# Altium project ProjectUshi.PrjPcb
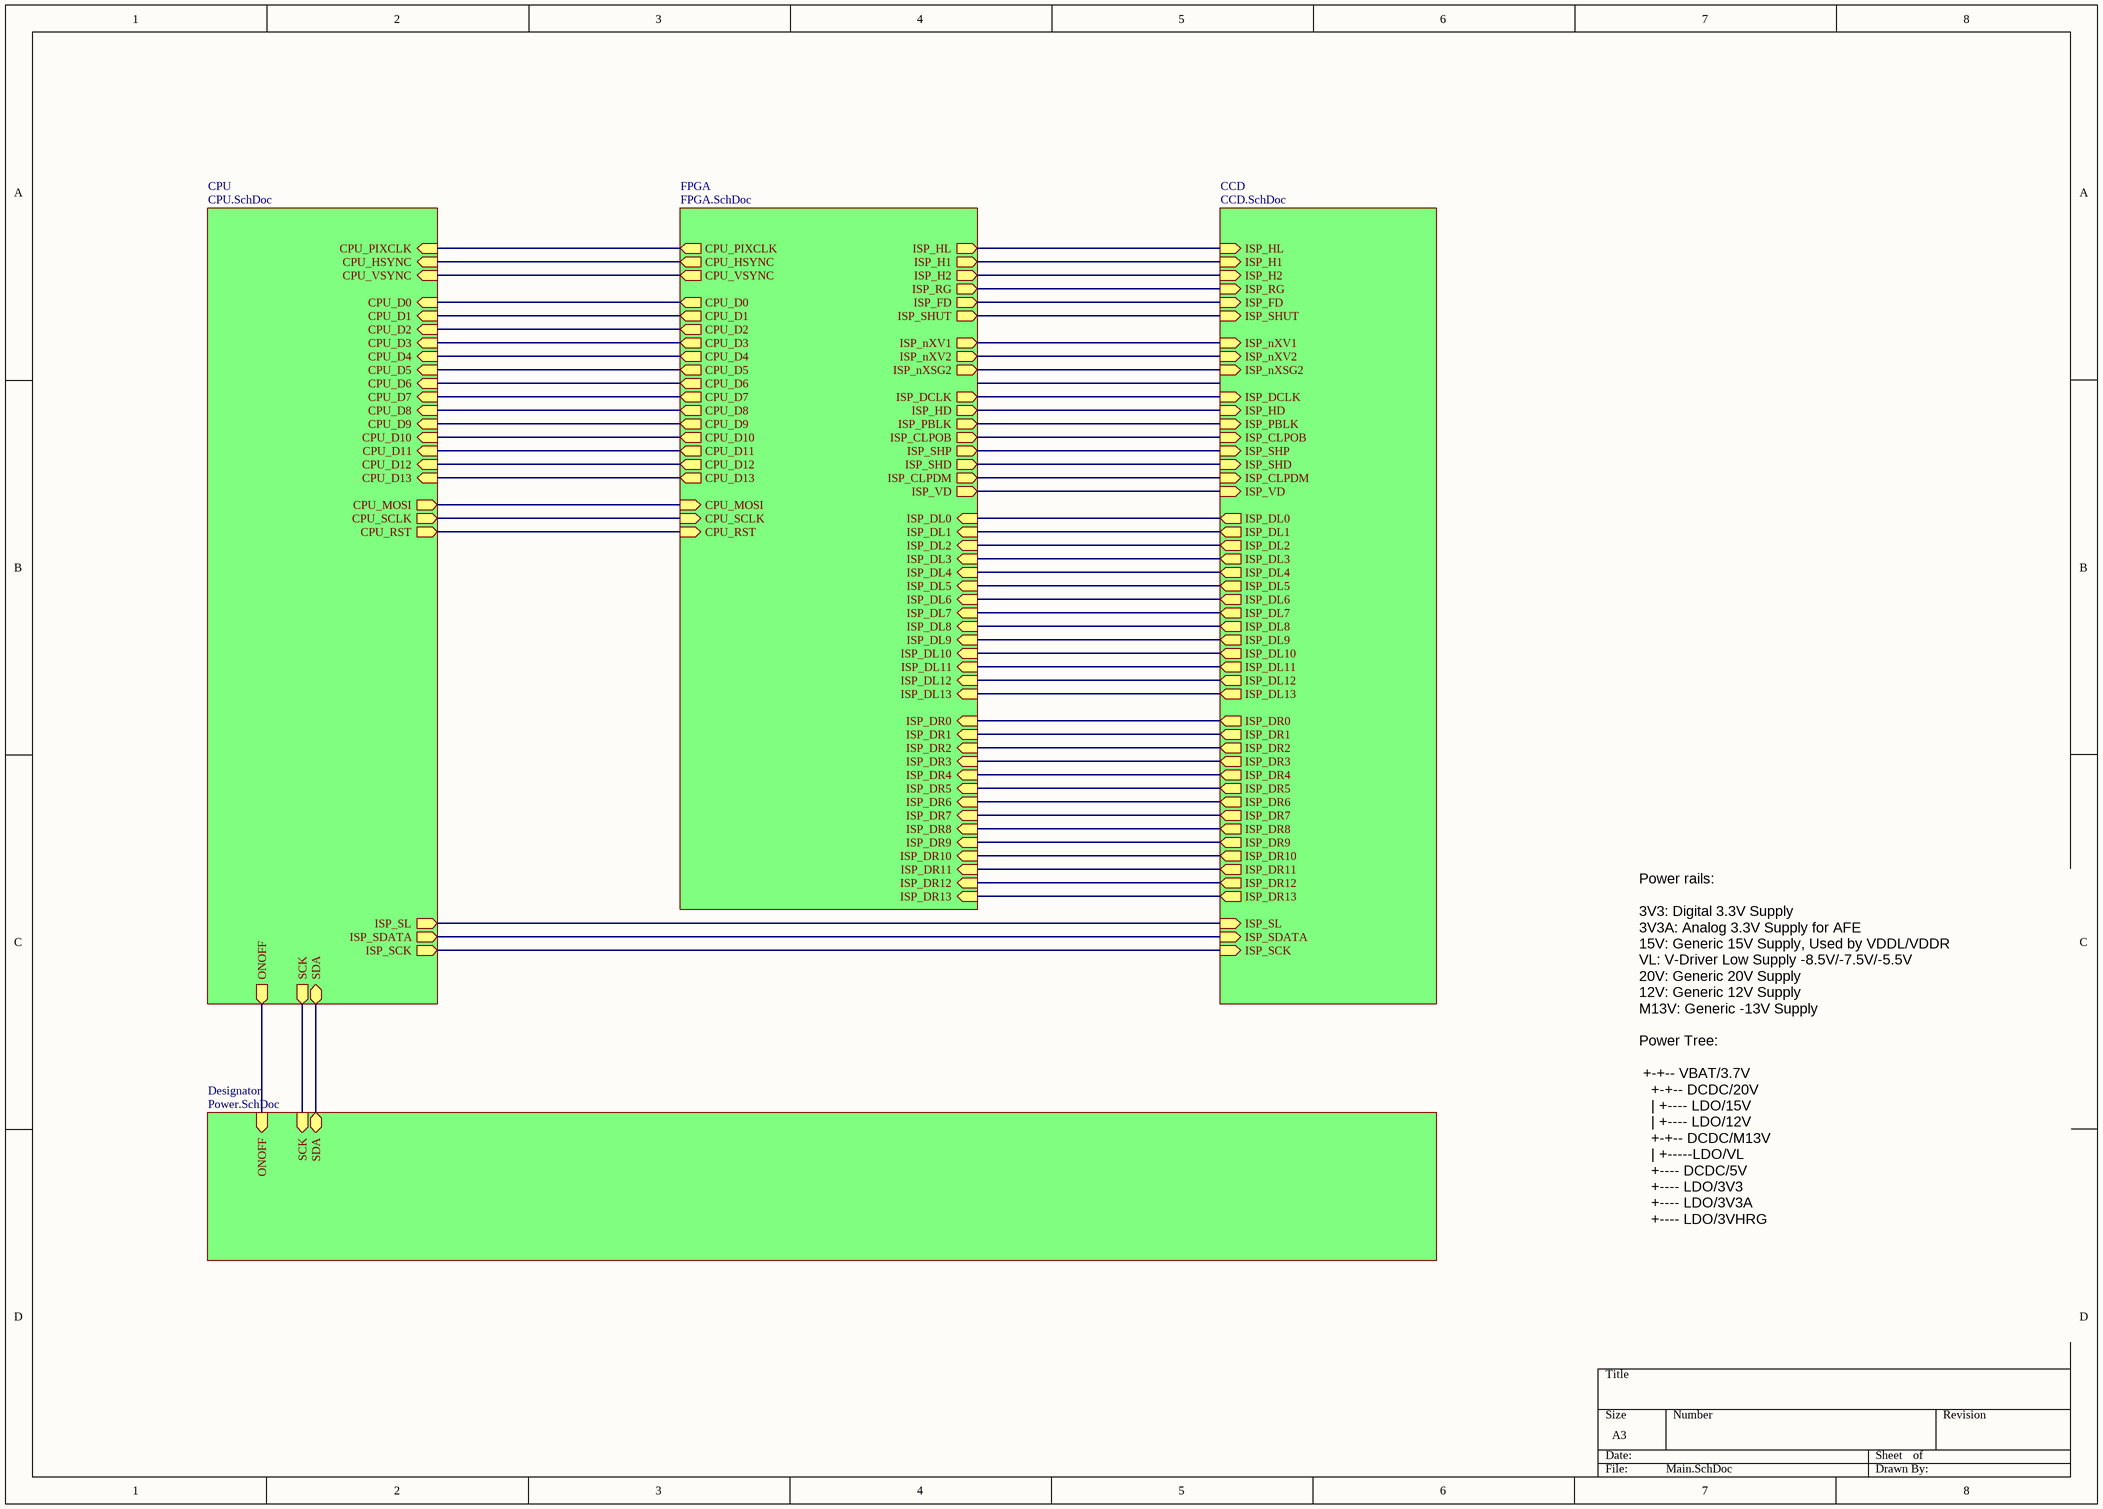
[diagram p0: Main.SchDoc]
5 sheets, 331 parts. Net scope: hierarchical (ports join the sheet entries above them; power ports are global).
Sheets:
  Main.SchDoc
    CCD = CCD.SchDoc
    FPGA = FPGA.SchDoc
    CPU = CPU.SchDoc
    Designator = Power.SchDoc

## Sheet Main.SchDoc
size A3

### Sub-sheets
CCD = CCD.SchDoc: ISP_HL (in), ISP_H1 (in), ISP_H2 (in), ISP_RG (in), ISP_FD (in), ISP_SHUT (in), ISP_nXV1 (in), ISP_nXV2 (in), ISP_nXSG2 (in), ISP_DCLK (in), ISP_HD (in), ISP_PBLK (in), ISP_CLPOB (in), ISP_SHP (in), ISP_SHD (in), ISP_CLPDM (in), ISP_VD (in), ISP_SL (in), ISP_SDATA (in), ISP_SCK (in), ISP_DL0 (out), ISP_DL1 (out), ISP_DL2 (out), ISP_DL3 (out), ISP_DL4 (out), ISP_DL5 (out), ISP_DL6 (out), ISP_DL7 (out), ISP_DL8 (out), ISP_DL9 (out), ISP_DL10 (out), ISP_DL11 (out), ISP_DL12 (out), ISP_DL13 (out), ISP_DR0 (out), ISP_DR1 (out), ISP_DR2 (out), ISP_DR3 (out), ISP_DR4 (out), ISP_DR5 (out), ISP_DR6 (out), ISP_DR7 (out), ISP_DR8 (out), ISP_DR9 (out), ISP_DR10 (out), ISP_DR11 (out), ISP_DR12 (out), ISP_DR13 (out)
CPU = CPU.SchDoc: CPU_PIXCLK (in), CPU_HSYNC (in), CPU_VSYNC (in), CPU_D0 (in), CPU_D1 (in), CPU_D2 (in), CPU_D3 (in), CPU_D4 (in), CPU_D5 (in), CPU_D6 (in), CPU_D7 (in), CPU_D8 (in), CPU_D9 (in), CPU_D10 (in), CPU_D11 (in), CPU_D12 (in), CPU_D13 (in), CPU_MOSI (out), CPU_SCLK (out), CPU_RST (out), ISP_SL (out), ISP_SDATA (out), ISP_SCK (out), ONOFF (out), SCK (out), SDA (bidir)
Designator = Power.SchDoc: ONOFF (in), SCK (in), SDA (bidir)
FPGA = FPGA.SchDoc: ISP_HL (out), ISP_H1 (out), ISP_H2 (out), ISP_RG (out), ISP_FD (out), ISP_SHUT (out), ISP_nXV1 (out), ISP_nXV2 (out), ISP_nXSG2 (out), ISP_DCLK (out), ISP_HD (out), ISP_PBLK (out), ISP_CLPOB (out), ISP_SHP (out), ISP_SHD (out), ISP_CLPDM (out), ISP_VD (out), ISP_DL0 (in), ISP_DL1 (in), ISP_DL2 (in), ISP_DL3 (in), ISP_DL4 (in), ISP_DL5 (in), ISP_DL6 (in), ISP_DL7 (in), ISP_DL8 (in), ISP_DL9 (in), ISP_DL10 (in), ISP_DL11 (in), ISP_DL12 (in), ISP_DL13 (in), ISP_DR0 (in), ISP_DR1 (in), ISP_DR2 (in), ISP_DR3 (in), ISP_DR4 (in), ISP_DR5 (in), ISP_DR6 (in), ISP_DR7 (in), ISP_DR8 (in), ISP_DR9 (in), ISP_DR10 (in), ISP_DR11 (in), ISP_DR12 (in), ISP_DR13 (in), CPU_PIXCLK (out), CPU_HSYNC (out), CPU_VSYNC (out), CPU_D0 (out), CPU_D1 (out), CPU_D2 (out), CPU_D3 (out), CPU_D4 (out), CPU_D5 (out), CPU_D6 (out), CPU_D7 (out), CPU_D8 (out), CPU_D9 (out), CPU_D10 (out), CPU_D11 (out), CPU_D12 (out), CPU_D13 (out), CPU_MOSI (in), CPU_SCLK (in), CPU_RST (in)

### Nets
CPU_D0: sheet FPGA/CPU_D0, sheet CPU/CPU_D0
CPU_D1: sheet FPGA/CPU_D1, sheet CPU/CPU_D1
CPU_D2: sheet FPGA/CPU_D2, sheet CPU/CPU_D2
CPU_D3: sheet FPGA/CPU_D3, sheet CPU/CPU_D3
CPU_D4: sheet FPGA/CPU_D4, sheet CPU/CPU_D4
CPU_D5: sheet FPGA/CPU_D5, sheet CPU/CPU_D5
CPU_D6: sheet FPGA/CPU_D6, sheet CPU/CPU_D6
CPU_D7: sheet FPGA/CPU_D7, sheet CPU/CPU_D7
CPU_D8: sheet FPGA/CPU_D8, sheet CPU/CPU_D8
CPU_D9: sheet FPGA/CPU_D9, sheet CPU/CPU_D9
CPU_D10: sheet FPGA/CPU_D10, sheet CPU/CPU_D10
CPU_D11: sheet FPGA/CPU_D11, sheet CPU/CPU_D11
CPU_D12: sheet FPGA/CPU_D12, sheet CPU/CPU_D12
CPU_D13: sheet FPGA/CPU_D13, sheet CPU/CPU_D13
CPU_HSYNC: sheet FPGA/CPU_HSYNC, sheet CPU/CPU_HSYNC
CPU_MOSI: sheet FPGA/CPU_MOSI, sheet CPU/CPU_MOSI
CPU_PIXCLK: sheet FPGA/CPU_PIXCLK, sheet CPU/CPU_PIXCLK
CPU_RST: sheet FPGA/CPU_RST, sheet CPU/CPU_RST
CPU_SCLK: sheet FPGA/CPU_SCLK, sheet CPU/CPU_SCLK
CPU_VSYNC: sheet FPGA/CPU_VSYNC, sheet CPU/CPU_VSYNC
FPGA_DL0: sheet CCD/ISP_DL0, sheet FPGA/ISP_DL0
FPGA_DL1: sheet CCD/ISP_DL1, sheet FPGA/ISP_DL1
FPGA_DL2: sheet CCD/ISP_DL2, sheet FPGA/ISP_DL2
FPGA_DL3: sheet CCD/ISP_DL3, sheet FPGA/ISP_DL3
FPGA_DL4: sheet CCD/ISP_DL4, sheet FPGA/ISP_DL4
FPGA_DL5: sheet CCD/ISP_DL5, sheet FPGA/ISP_DL5
FPGA_DL6: sheet CCD/ISP_DL6, sheet FPGA/ISP_DL6
FPGA_DL7: sheet CCD/ISP_DL7, sheet FPGA/ISP_DL7
FPGA_DL8: sheet CCD/ISP_DL8, sheet FPGA/ISP_DL8
FPGA_DL9: sheet CCD/ISP_DL9, sheet FPGA/ISP_DL9
FPGA_DL10: sheet CCD/ISP_DL10, sheet FPGA/ISP_DL10
FPGA_DL11: sheet CCD/ISP_DL11, sheet FPGA/ISP_DL11
FPGA_DL12: sheet CCD/ISP_DL12, sheet FPGA/ISP_DL12
FPGA_DL13: sheet CCD/ISP_DL13, sheet FPGA/ISP_DL13
FPGA_DR0: sheet CCD/ISP_DR0, sheet FPGA/ISP_DR0
FPGA_DR1: sheet CCD/ISP_DR1, sheet FPGA/ISP_DR1
FPGA_DR2: sheet CCD/ISP_DR2, sheet FPGA/ISP_DR2
FPGA_DR3: sheet CCD/ISP_DR3, sheet FPGA/ISP_DR3
FPGA_DR4: sheet CCD/ISP_DR4, sheet FPGA/ISP_DR4
FPGA_DR5: sheet CCD/ISP_DR5, sheet FPGA/ISP_DR5
FPGA_DR6: sheet CCD/ISP_DR6, sheet FPGA/ISP_DR6
FPGA_DR7: sheet CCD/ISP_DR7, sheet FPGA/ISP_DR7
FPGA_DR8: sheet CCD/ISP_DR8, sheet FPGA/ISP_DR8
FPGA_DR9: sheet CCD/ISP_DR9, sheet FPGA/ISP_DR9
FPGA_DR10: sheet CCD/ISP_DR10, sheet FPGA/ISP_DR10
FPGA_DR11: sheet CCD/ISP_DR11, sheet FPGA/ISP_DR11
FPGA_DR12: sheet CCD/ISP_DR12, sheet FPGA/ISP_DR12
FPGA_DR13: sheet CCD/ISP_DR13, sheet FPGA/ISP_DR13
I2C1_SCL: sheet CPU/SCK, sheet Designator/SCK
I2C1_SDA: sheet CPU/SDA, sheet Designator/SDA
ISP_CLPDM: sheet CCD/ISP_CLPDM, sheet FPGA/ISP_CLPDM
ISP_CLPOB: sheet CCD/ISP_CLPOB, sheet FPGA/ISP_CLPOB
ISP_DCLK: sheet CCD/ISP_DCLK, sheet FPGA/ISP_DCLK
ISP_FD: sheet CCD/ISP_FD, sheet FPGA/ISP_FD
ISP_H1: sheet CCD/ISP_H1, sheet FPGA/ISP_H1
ISP_H2: sheet CCD/ISP_H2, sheet FPGA/ISP_H2
ISP_HD: sheet CCD/ISP_HD, sheet FPGA/ISP_HD
ISP_HL: sheet CCD/ISP_HL, sheet FPGA/ISP_HL
ISP_nXSG2: sheet CCD/ISP_nXSG2, sheet FPGA/ISP_nXSG2
ISP_nXV1: sheet CCD/ISP_nXV1, sheet FPGA/ISP_nXV1
ISP_nXV2: sheet CCD/ISP_nXV2, sheet FPGA/ISP_nXV2
ISP_PBLK: sheet CCD/ISP_PBLK, sheet FPGA/ISP_PBLK
ISP_RG: sheet CCD/ISP_RG, sheet FPGA/ISP_RG
ISP_SCK: sheet CCD/ISP_SCK, sheet CPU/ISP_SCK
ISP_SDATA: sheet CCD/ISP_SDATA, sheet CPU/ISP_SDATA
ISP_SHD: sheet CCD/ISP_SHD, sheet FPGA/ISP_SHD
ISP_SHP: sheet CCD/ISP_SHP, sheet FPGA/ISP_SHP
ISP_SHUT: sheet CCD/ISP_SHUT, sheet FPGA/ISP_SHUT
ISP_SL: sheet CCD/ISP_SL, sheet CPU/ISP_SL
ISP_VD: sheet CCD/ISP_VD, sheet FPGA/ISP_VD
ONOFF: sheet CPU/ONOFF, sheet Designator/ONOFF

### Notes on the sheet
- Power rails:
  3V3: Digital 3.3V Supply
  3V3A: Analog 3.3V Supply for AFE
  15V: Generic 15V Supply, Used by VDDL/VDDR
  VL: V-Driver Low Supply -8.5V/-7.5V/-5.5V
  20V: Generic 20V Supply
  12V: Generic 12V Supply
  M13V: Generic -13V Supply
  Power Tree:
  +-+-- VBAT/3.7V
  +-+-- DCDC/20V
  | +---- LDO/15V
  | +---- LDO/12V
  +-+-- DCDC/M13V
  | +-----LDO/VL
  +---- DCDC/5V
  +---- LDO/3V3
  +---- LDO/3V3A
  +---- LDO/3VHRG

## Sheet CCD.SchDoc
size A3
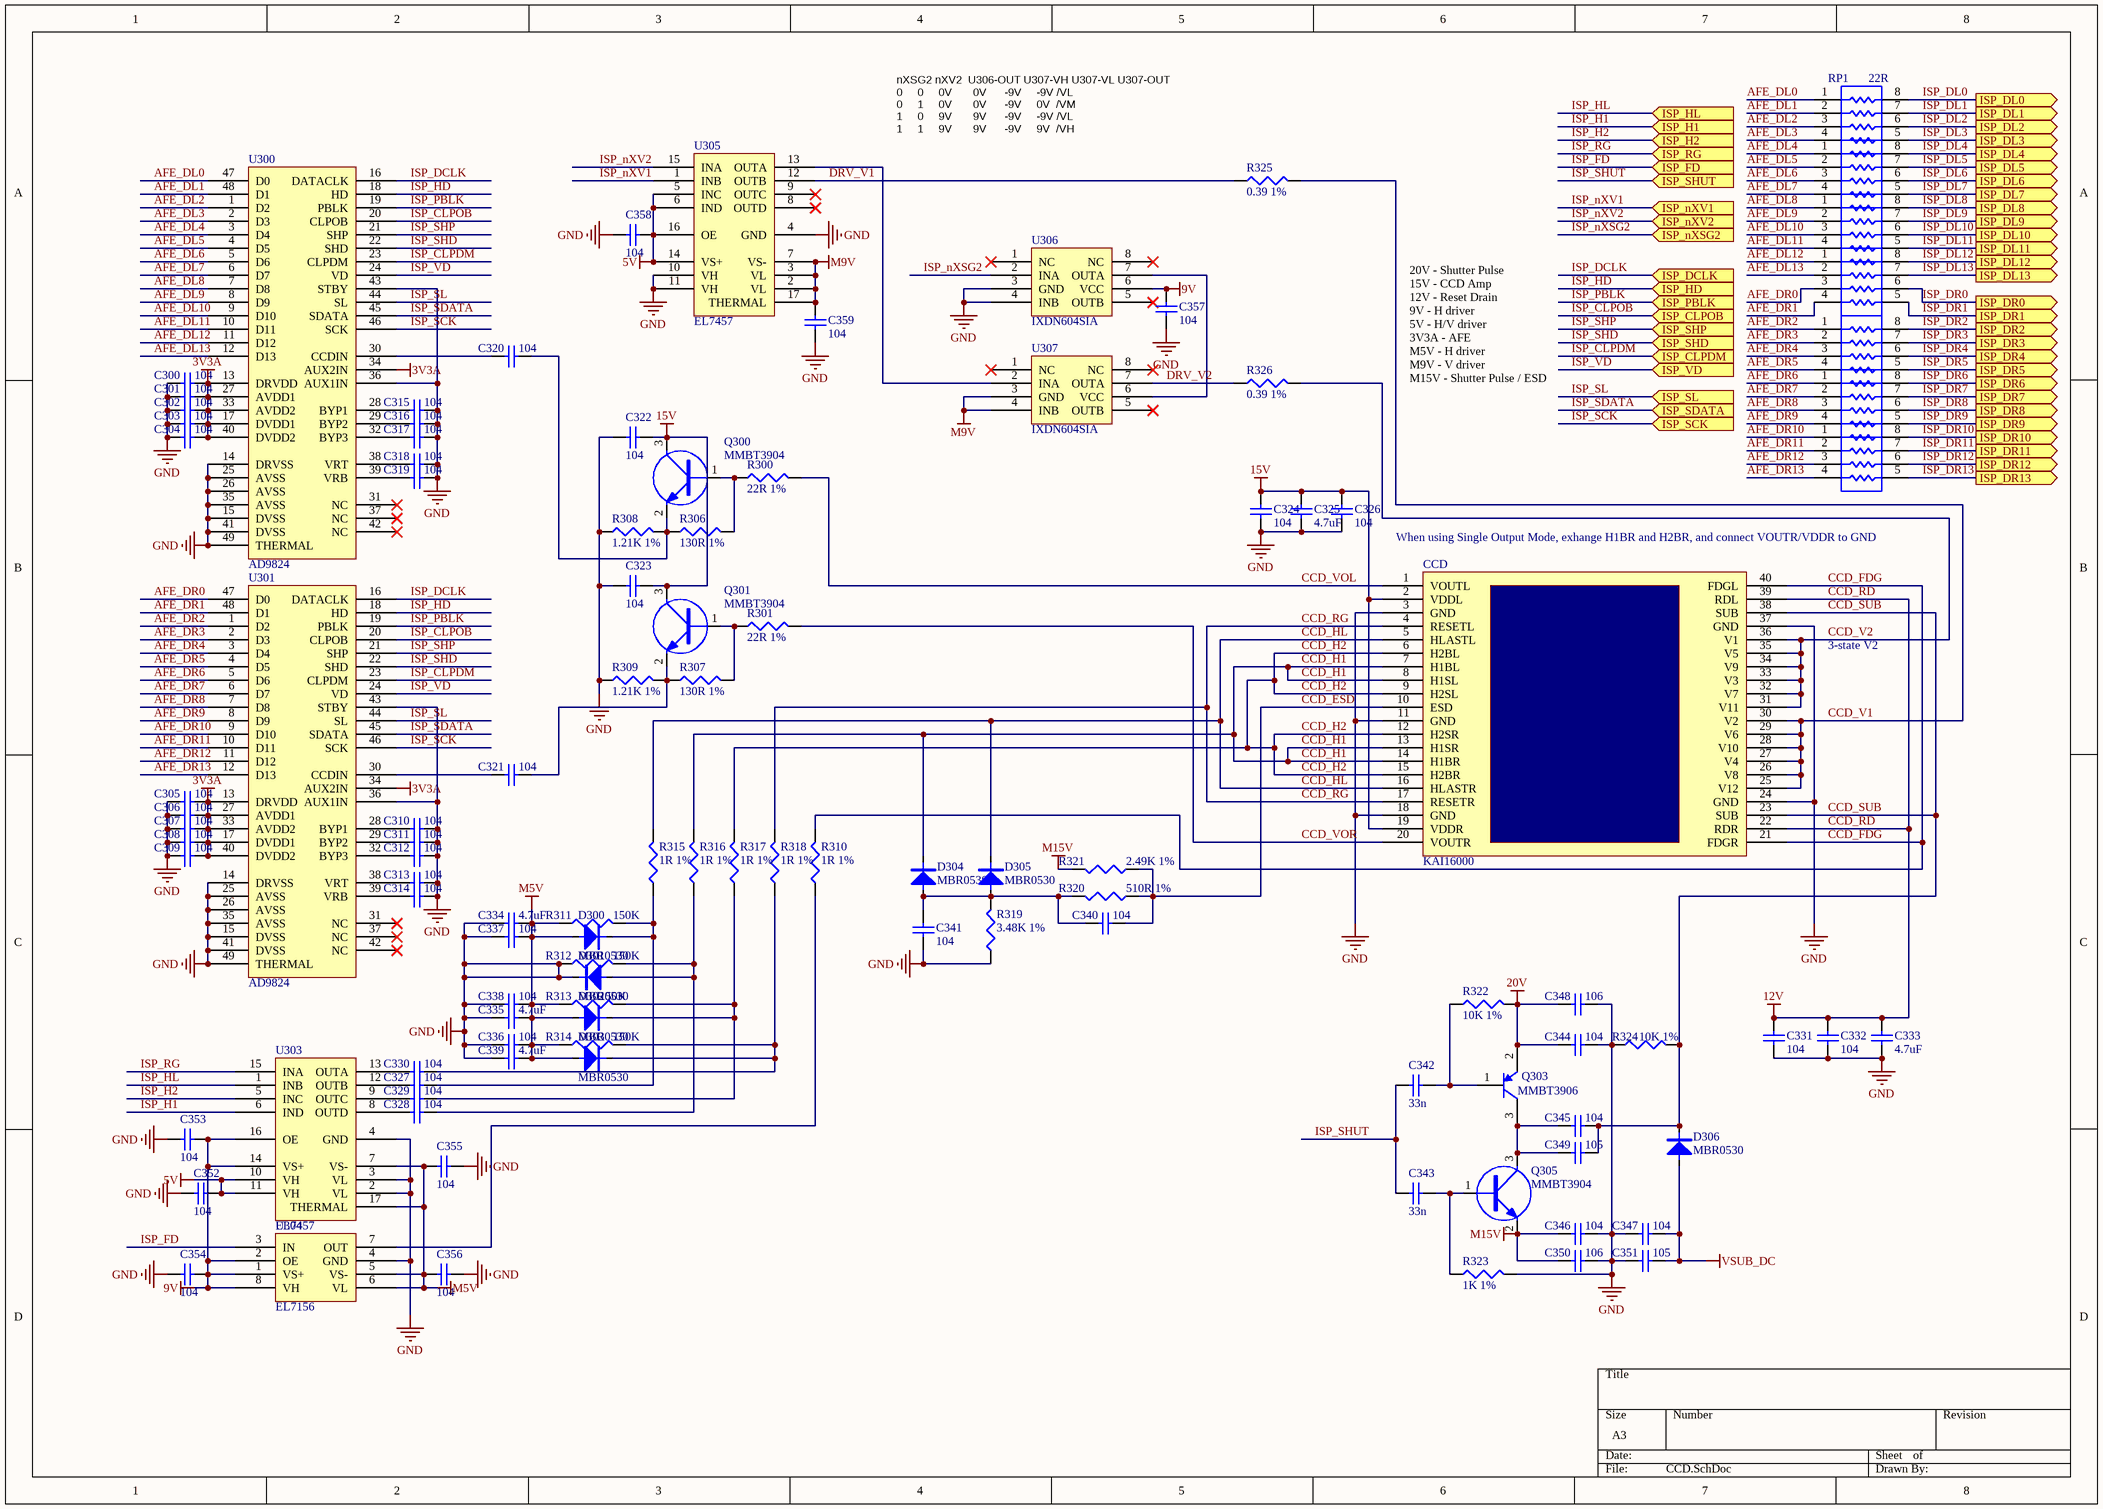
[diagram p1: CCD.SchDoc]

### Parts
C300  104  [C0402]
C301  104  [C0402]
C302  104  [C0402]
C303  104  [C0402]
C304  104  [C0402]
C305  104  [C0402]
C306  104  [C0402]
C307  104  [C0402]
C308  104  [C0402]
C309  104  [C0402]
C310  104  [C0402]
C311  104  [C0402]
C312  104  [C0402]
C313  104  [C0402]
C314  104  [C0402]
C315  104  [C0402]
C316  104  [C0402]
C317  104  [C0402]
C318  104  [C0402]
C319  104  [C0402]
C320  104  [C0402]
C321  104  [C0402]
C322  104  [C0402]
C323  104  [C0402]
C324  104  [C0402]
C325  4.7uF  [C0603]
C326  104  [C0402]
C327  104  [C0402]
C328  104  [C0402]
C329  104  [C0402]
C330  104  [C0402]
C331  104  [C0402]
C332  104  [C0402]
C333  4.7uF  [C0603]
C334  104  [C0603]
C335  4.7uF  [C0603]
C336  104  [C0603]
C337  4.7uF  [C0603]
C338  104  [C0603]
C339  4.7uF  [C0603]
C340  104  [C0603]
C341  104  [C0603]
C342  33n  [C0402]
C343  33n  [C0402]
C344  104  [C0402]
C345  104  [C0402]
C346  104  [C0402]
C347  104  [C0402]
C348  106  [C0805]
C349  105  [C0805]
C350  106  [C0805]
C351  105  [C0805]
C352  104  [C0603]
C353  104  [C0603]
C354  104  [C0603]
C355  104  [C0603]
C356  104  [C0603]
C357  104  [C0603]
C358  104  [C0603]
C359  104  [C0603]
CCD  KAI16000  [KAI16000]
D300  MBR0530  [SOD123]
D301  MBR0530  [SOD123]
D302  MBR0530  [SOD123]
D303  MBR0530  [SOD123]
D304  MBR0530  [SOD123]
D305  MBR0530  [SOD123]
D306  MBR0530  [SOD123]
Q300  MMBT3904  [SOT23]
Q301  MMBT3904  [SOT23]
Q303  MMBT3906  [SOT23]
Q305  MMBT3904  [SOT23]
R300  22R 1%  [R0603]
R301  22R 1%  [R0603]
R306  130R 1%  [R0603]
R307  130R 1%  [R0603]
R308  1.21K 1%  [R0603]
R309  1.21K 1%  [R0603]
R310  1R 1%  [R0805]
R311  150K  [R0603]
R312  150K  [R0603]
R313  150K  [R0603]
R314  150K  [R0603]
R315  1R 1%  [R0805]
R316  1R 1%  [R0805]
R317  1R 1%  [R0805]
R318  1R 1%  [R0805]
R319  3.48K 1%  [R0603]
R320  510R 1%  [R0603]
R321  2.49K 1%  [R0603]
R322  10K 1%  [R0603]
R323  1K 1%  [R0603]
R324  10K 1%  [R0603]
R325  0.39 1%  [R0603]
R326  0.39 1%  [R0603]
RP1  22R  [R0402S4]
RP2  22R  [R0402S4]  (value not drawn)
RP3  22R  [R0402S4]  (value not drawn)
RP4  22R  [R0402S4]  (value not drawn)
RP5  22R  [R0402S4]  (value not drawn)
RP6  22R  [R0402S4]  (value not drawn)
RP7  22R  [R0402S4]  (value not drawn)
U300  AD9824  [CP-48]
U301  AD9824  [CP-48]
U303  EL7457  [QFN16]
U304  EL7156  [SOP-8]
U305  EL7457  [QFN16]
U306  IXDN604SIA  [SOP8]
U307  IXDN604SIA  [SOP8]

### Ports
ISP_CLPDM (in), ISP_CLPOB (in), ISP_DCLK (in), ISP_DL0 (out), ISP_DL1 (out), ISP_DL2 (out), ISP_DL3 (out), ISP_DL4 (out), ISP_DL5 (out), ISP_DL6 (out), ISP_DL7 (out), ISP_DL8 (out), ISP_DL9 (out), ISP_DL10 (out), ISP_DL11 (out), ISP_DL12 (out), ISP_DL13 (out), ISP_DR0 (out), ISP_DR1 (out), ISP_DR2 (out), ISP_DR3 (out), ISP_DR4 (out), ISP_DR5 (out), ISP_DR6 (out), ISP_DR7 (out), ISP_DR8 (out), ISP_DR9 (out), ISP_DR10 (out), ISP_DR11 (out), ISP_DR12 (out), ISP_DR13 (out), ISP_FD (in), ISP_H1 (in), ISP_H2 (in), ISP_HD (in), ISP_HL (in), ISP_nXSG2 (in), ISP_nXV1 (in), ISP_nXV2 (in), ISP_PBLK (in), ISP_RG (in), ISP_SCK (in), ISP_SDATA (in), ISP_SHD (in), ISP_SHP (in), ISP_SHUT (in), ISP_SL (in), ISP_VD (in)

### Nets
3V3A: C300.2 C301.2 C302.2 C303.2 C304.2 C305.2 C306.2 C307.2 C308.2 C309.2 U300.13(DRVDD) U300.17(DVDD1) U300.27(AVDD1) U300.33(AVDD2) U300.34(AUX2IN) U300.40(DVDD2) U301.13(DRVDD) U301.17(DVDD1) U301.27(AVDD1) U301.33(AVDD2) U301.34(AUX2IN) U301.40(DVDD2)
5V: C352.2 C358.2 U303.10(VH) U303.11(VH) U305.5(INC) U305.6(IND) U305.14(VS+) U305.16(OE)
9V: C353.1 C354.1 C357.1 U303.14(VS+) U303.16(OE) U304.1(VS+) U304.2(OE) U304.8(VH) U306.6(VCC)
15V: C322.2 C323.2 C324.2 C325.2 C326.2 CCD.2(VDDL) CCD.19(VDDR) Q300.3(C) Q301.3(C)
20V: C344.1 C348.1 Q303.2(E) R322.2
CCD_RD: C331.2 C332.2 C333.2 CCD.22(RDR) CCD.39(RDL)  [also labelled 12V]
GND: C300.1 C301.1 C302.1 C303.1 C304.1 C305.1 C306.1 C307.1 C308.1 C309.1 C310.2 C311.2 C312.2 C313.2 C314.2 C315.2 C316.2 C317.2 C318.2 C319.2 C322.1 C323.1 C324.1 C325.1 C326.1 C331.1 C332.1 C333.1 C334.1 C335.1 C336.1 C337.1 C338.1 C339.1 C341.1 C344.2 C346.2 C347.1 C348.2 C350.2 C351.1 C352.1 C353.2 C354.2 C355.1 C356.1 C357.2 C358.1 C359.1 CCD.3(GND) CCD.11(GND) CCD.18(GND) CCD.24(GND) CCD.37(GND) D301.2 R308.1 R309.1 R312.1 R319.1 R323.2 R324.1 U300.14(DRVSS) U300.15(DVSS) U300.25(AVSS) U300.26(AVSS) U300.35(AVSS) U300.36(AUX1IN) U300.41(DVSS) U300.43(STBY) U300.49(THERMAL) U301.14(DRVSS) U301.15(DVSS) U301.25(AVSS) U301.26(AVSS) U301.35(AVSS) U301.36(AUX1IN) U301.41(DVSS) U301.43(STBY) U301.49(THERMAL) U303.2(VL) U303.3(VL) U303.4(GND) U304.4(GND) U305.4(GND) U305.10(VH) U305.11(VH) U306.3(GND) U306.4(INB)  [project net SUSPEND]
M5V: C334.2 C335.2 C336.2 C337.2 C338.2 C339.2 C355.2 C356.2 D300.1 D302.1 D303.1 R311.1 R313.1 R314.1 U303.7(VS-) U303.17(THERMAL) U304.5(VS-) U304.6(VL)
M9V: C359.2 U305.2(VL) U305.3(VL) U305.7(VS-) U305.17(THERMAL) U307.3(GND) U307.4(INB)
M15V: C346.1 C350.1 Q305.2(E) R321.2
VSUB_DC: C347.2 C351.2 D306.1
AFE_DL0: RP1.1 U300.47(D0)
AFE_DL1: RP1.2 U300.48(D1)
AFE_DL2: RP1.3 U300.1(D2)
AFE_DL3: RP1.4 U300.2(D3)
AFE_DL4: RP2.1 U300.3(D4)
AFE_DL5: RP2.2 U300.4(D5)
AFE_DL6: RP2.3 U300.5(D6)
AFE_DL7: RP2.4 U300.6(D7)
AFE_DL8: RP3.1 U300.7(D8)
AFE_DL9: RP3.2 U300.8(D9)
AFE_DL10: RP3.3 U300.9(D10)
AFE_DL11: RP3.4 U300.10(D11)
AFE_DL12: RP4.1 U300.11(D12)
AFE_DL13: RP4.2 U300.12(D13)
AFE_DR0: RP4.3 U301.47(D0)
AFE_DR1: RP4.4 U301.48(D1)
AFE_DR2: RP5.1 U301.1(D2)
AFE_DR3: RP5.2 U301.2(D3)
AFE_DR4: RP5.3 U301.3(D4)
AFE_DR5: RP5.4 U301.4(D5)
AFE_DR6: RP7.1 U301.5(D6)
AFE_DR7: RP7.2 U301.6(D7)
AFE_DR8: RP7.3 U301.7(D8)
AFE_DR9: RP7.4 U301.8(D9)
AFE_DR10: RP6.1 U301.9(D10)
AFE_DR11: RP6.2 U301.10(D11)
AFE_DR12: RP6.3 U301.11(D12)
AFE_DR13: RP6.4 U301.12(D13)
CCD_ESD: C340.2 CCD.10(ESD) R320.1 R321.1
CCD_FDG: CCD.21(FDGR) CCD.40(FDGL) R310.2
CCD_H1: CCD.7(H1BL) CCD.8(H1SL) CCD.13(H1SR) CCD.14(H1BR) D304.2 R316.2
CCD_H2: CCD.6(H2BL) CCD.9(H2SL) CCD.12(H2SR) CCD.15(H2BR) R317.2
CCD_HL: CCD.5(HLASTL) CCD.16(HLASTR) D305.2 R315.2
CCD_RG: CCD.4(RESETL) CCD.17(RESETR) R318.2
CCD_SUB: C345.2 C349.2 CCD.23(SUB) CCD.38(SUB) D306.2 R324.2
CCD_V1: CCD.25(V12) CCD.26(V8) CCD.27(V4) CCD.28(V10) CCD.29(V6) CCD.30(V2) R325.2
CCD_V2: CCD.31(V11) CCD.32(V7) CCD.33(V3) CCD.34(V9) CCD.35(V5) CCD.36(V1) R326.2
CCD_VOL: CCD.1(VOUTL) R300.2
CCD_VOR: CCD.20(VOUTR) R301.2
DRV_V1: R325.1 U305.12(OUTB)
DRV_V2: R326.1 U307.7(OUTA)
ISP_CLPDM: U300.23(CLPDM) U301.23(CLPDM) ; port ISP_CLPDM
ISP_CLPOB: U300.20(CLPOB) U301.20(CLPOB) ; port ISP_CLPOB
ISP_DCLK: U300.16(DATACLK) U301.16(DATACLK) ; port ISP_DCLK
ISP_DL0: RP1.8 ; port ISP_DL0  [project net FPGA_DL0]
ISP_DL1: RP1.7 ; port ISP_DL1  [project net FPGA_DL1]
ISP_DL2: RP1.6 ; port ISP_DL2  [project net FPGA_DL2]
ISP_DL3: RP1.5 ; port ISP_DL3  [project net FPGA_DL3]
ISP_DL4: RP2.8 ; port ISP_DL4  [project net FPGA_DL4]
ISP_DL5: RP2.7 ; port ISP_DL5  [project net FPGA_DL5]
ISP_DL6: RP2.6 ; port ISP_DL6  [project net FPGA_DL6]
ISP_DL7: RP2.5 ; port ISP_DL7  [project net FPGA_DL7]
ISP_DL8: RP3.8 ; port ISP_DL8  [project net FPGA_DL8]
ISP_DL9: RP3.7 ; port ISP_DL9  [project net FPGA_DL9]
ISP_DL10: RP3.6 ; port ISP_DL10  [project net FPGA_DL10]
ISP_DL11: RP3.5 ; port ISP_DL11  [project net FPGA_DL11]
ISP_DL12: RP4.8 ; port ISP_DL12  [project net FPGA_DL12]
ISP_DL13: RP4.7 ; port ISP_DL13  [project net FPGA_DL13]
ISP_DR0: RP4.6 ; port ISP_DR0  [project net FPGA_DR0]
ISP_DR1: RP4.5 ; port ISP_DR1  [project net FPGA_DR1]
ISP_DR2: RP5.8 ; port ISP_DR2  [project net FPGA_DR2]
ISP_DR3: RP5.7 ; port ISP_DR3  [project net FPGA_DR3]
ISP_DR4: RP5.6 ; port ISP_DR4  [project net FPGA_DR4]
ISP_DR5: RP5.5 ; port ISP_DR5  [project net FPGA_DR5]
ISP_DR6: RP7.8 ; port ISP_DR6  [project net FPGA_DR6]
ISP_DR7: RP7.7 ; port ISP_DR7  [project net FPGA_DR7]
ISP_DR8: RP7.6 ; port ISP_DR8  [project net FPGA_DR8]
ISP_DR9: RP7.5 ; port ISP_DR9  [project net FPGA_DR9]
ISP_DR10: RP6.8 ; port ISP_DR10  [project net FPGA_DR10]
ISP_DR11: RP6.7 ; port ISP_DR11  [project net FPGA_DR11]
ISP_DR12: RP6.6 ; port ISP_DR12  [project net FPGA_DR12]
ISP_DR13: RP6.5 ; port ISP_DR13  [project net FPGA_DR13]
ISP_FD: U304.3(IN) ; port ISP_FD
ISP_H1: U303.6(IND) ; port ISP_H1
ISP_H2: U303.5(INC) ; port ISP_H2
ISP_HD: U300.18(HD) U301.18(HD) ; port ISP_HD
ISP_HL: U303.1(INB) ; port ISP_HL
ISP_nXSG2: U306.2(INA) ; port ISP_nXSG2
ISP_nXV1: U305.1(INB) ; port ISP_nXV1
ISP_nXV2: U305.15(INA) ; port ISP_nXV2
ISP_PBLK: U300.19(PBLK) U301.19(PBLK) ; port ISP_PBLK
ISP_RG: U303.15(INA) ; port ISP_RG
ISP_SCK: U300.46(SCK) U301.46(SCK) ; port ISP_SCK
ISP_SDATA: U300.45(SDATA) U301.45(SDATA) ; port ISP_SDATA
ISP_SHD: U300.22(SHD) U301.22(SHD) ; port ISP_SHD
ISP_SHP: U300.21(SHP) U301.21(SHP) ; port ISP_SHP
ISP_SHUT: C342.1 C343.1 ; port ISP_SHUT
ISP_SL: U300.44(SL) U301.44(SL) ; port ISP_SL
ISP_VD: U300.24(VD) U301.24(VD) ; port ISP_VD
NetC310_1: C310.1 U301.28(BYP1)
NetC311_1: C311.1 U301.29(BYP2)
NetC312_1: C312.1 U301.32(BYP3)
NetC313_1: C313.1 U301.38(VRT)
NetC314_1: C314.1 U301.39(VRB)
NetC315_1: C315.1 U300.28(BYP1)
NetC316_1: C316.1 U300.29(BYP2)
NetC317_1: C317.1 U300.32(BYP3)
NetC318_1: C318.1 U300.38(VRT)
NetC319_1: C319.1 U300.39(VRB)
NetC320_1: C320.1 U300.30(CCDIN)
NetC320_2: C320.2 Q300.2(E) R306.1 R308.2
NetC321_1: C321.1 U301.30(CCDIN)
NetC321_2: C321.2 Q301.2(E) R307.1 R309.2
NetC327_1: C327.1 U303.12(OUTB)
NetC327_2: C327.2 D300.2 R311.2 R315.1
NetC328_1: C328.1 U303.8(OUTD)
NetC328_2: C328.2 D301.1 R312.2 R316.1
NetC329_1: C329.1 U303.9(OUTC)
NetC329_2: C329.2 D302.2 R313.2 R317.1
NetC330_1: C330.1 U303.13(OUTA)
NetC330_2: C330.2 D303.2 R314.2 R318.1
NetC340_1: C340.1 C341.2 D304.1 D305.1 R319.2 R320.2
NetC342_2: C342.2 Q303.1(B) R322.1
NetC343_2: C343.2 Q305.1(B) R323.1
NetC345_1: C345.1 C349.1 Q303.3(C) Q305.3(C)
NetQ300_1: Q300.1(B) R300.1 R306.2
NetQ301_1: Q301.1(B) R301.1 R307.2
NetR310_1: R310.1 U304.7(OUT)
NetU305_13: U305.13(OUTA) U307.2(INA)
NetU306_7: U306.7(OUTA) U307.6(VCC)

Not connected (* = marked no-connect by the designer): U300 31(NC)* 37(NC)* 42(NC)*; U301 31(NC)* 37(NC)* 42(NC)*; U305 8(OUTD)* 9(OUTC)*; U306 1(NC)* 5(OUTB)* 8(NC)*; U307 1(NC)* 5(OUTB)* 8(NC)*

### Notes on the sheet
- nXSG2 nXV2  U306-OUT U307-VH U307-VL U307-OUT
  0     0     0V       0V      -9V     -9V /VL
  0     1     0V       0V      -9V     0V  /VM
  1     0     9V       9V      -9V     -9V /VL
  1     1     9V       9V      -9V     9V  /VH
- 20V - Shutter Pulse
  15V - CCD Amp
  12V - Reset Drain
  9V - H driver
  5V - H/V driver
  3V3A - AFE
  M5V - H driver
  M9V - V driver
  M15V - Shutter Pulse / ESD
- When using Single Output Mode, exhange H1BR and H2BR, and connect VOUTR/VDDR to GND
- 3-state V2

### Library data of the parts
C300-C359 = Cap Semi: Capacitor (Semiconductor SIM Model); Value: 100pF; Published: 8-Jun-2000; LatestRevisionDate: 29-May-2009; LatestRevisionNote: IPC-7351 Footprint Added.; PackageReference: C1206; Publisher: Altium Limited; PackageDescription: Chip Capacitor
R300 R301 R306-R322 R324-R326 = Res3: Resistor; Value: 1K; Published: 8-Jun-2000; LatestRevisionDate: 29-May-2009; LatestRevisionNote: IPC-7351 Footprint Added.; PackageReference: J1-0603; Publisher: Altium Limited; PackageDescription: Chip Resistor
R323 = Res3: Resistor; Published: 8-Jun-2000; LatestRevisionDate: 29-May-2009; LatestRevisionNote: IPC-7351 Footprint Added.; PackageReference: J1-0603; Publisher: Altium Limited; PackageDescription: Chip Resistor; Value: 1K
RP1-RP7 = ResPack: Isolated Resistor Network; Value: 1K; Published: 24-Mar-1999; LatestRevisionDate: 29-May-2009; LatestRevisionNote: IPC-7351 Footprint Added.; PackageReference: SO-16; Publisher: Altium Limited; PackageDescription: 16-Pin Small Outline Integrated Circuit 1.27 mm Pitch; Code_JEDEC: MS-012-AC; Code_IPC: SOIC127P600-16
Q303 = MMBT3906: Published: 8-Jun-2000; LatestRevisionDate: 29-May-2009; LatestRevisionNote: IPC-7351 Footprint Added.; PackageVersion: Aug-1999; PackageReference: SOT-23B; Publisher: Altium Limited; PackageDescription: 3-Pin SOT-23 Package 0.95 mm Pitch, 2.4 mm Lead Span

## Sheet FPGA.SchDoc
size A3
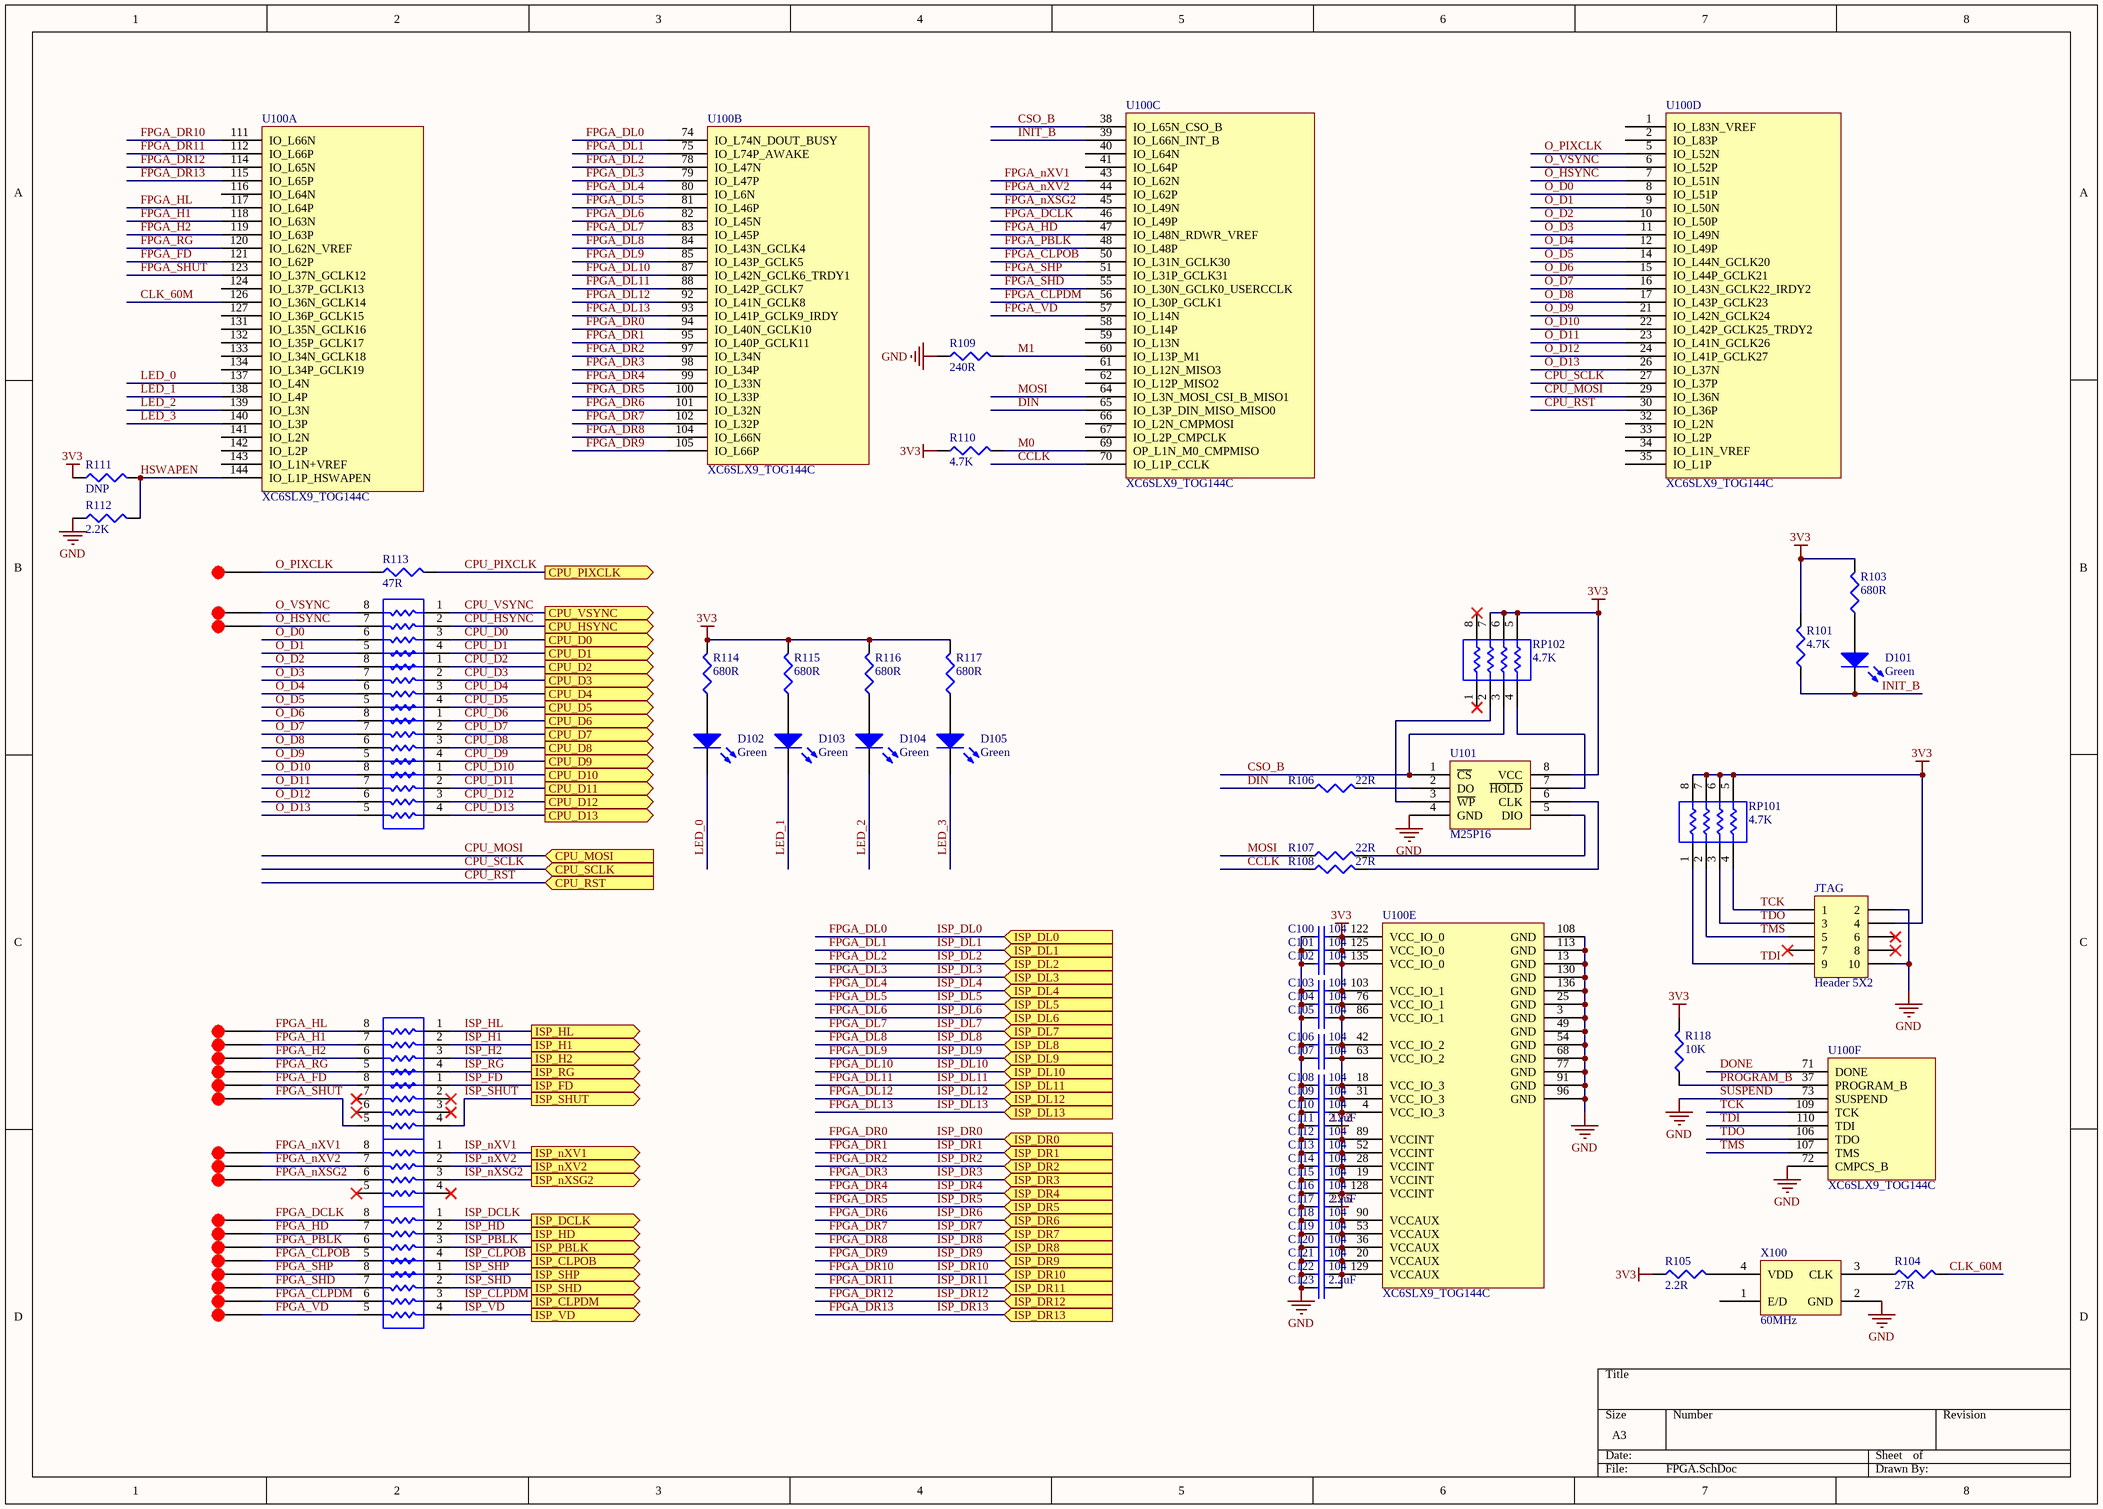
[diagram p2: FPGA.SchDoc]

### Parts
C100  104  [C0402]
C101  104  [C0402]
C102  104  [C0402]
C103  104  [C0402]
C104  104  [C0402]
C105  104  [C0402]
C106  104  [C0402]
C107  104  [C0402]
C108  104  [C0402]
C109  104  [C0402]
C110  104  [C0402]
C111  2.2uF  [C0603]
C112  104  [C0402]
C113  104  [C0402]
C114  104  [C0402]
C115  104  [C0402]
C116  104  [C0402]
C117  2.2uF  [C0603]
C118  104  [C0402]
C119  104  [C0402]
C120  104  [C0402]
C121  104  [C0402]
C122  104  [C0402]
C123  2.2uF  [C0603]
D101  Green  [D0805]
D102  Green  [D0805]
D103  Green  [D0805]
D104  Green  [D0805]
D105  Green  [D0805]
JTAG  Header 5X2  [HEADER10]
R101  4.7K  [R0603]
R103  680R  [R0603]
R104  27R  [R0603]
R105  2.2R  [R0603]
R106  22R  [R0603]
R107  22R  [R0603]
R108  27R  [R0603]
R109  240R  [R0603]
R110  4.7K  [R0603]
R111  DNP  [R0603]
R112  2.2K  [R0603]
R113  47R  [R0603]
R114  680R  [R0603]
R115  680R  [R0603]
R116  680R  [R0603]
R117  680R  [R0603]
R118  10K  [R0603]
RP101  4.7K  [R0402S4]
RP102  4.7K  [R0402S4]
RP103  22R  [R0402S4]  (value not drawn)
RP104  22R  [R0402S4]  (value not drawn)
RP105  22R  [R0402S4]  (value not drawn)
RP106  22R  [R0402S4]  (value not drawn)
RP107  22R  [R0402S4]  (value not drawn)
RP108  22R  [R0402S4]  (value not drawn)
RP109  22R  [R0402S4]  (value not drawn)
RP110  22R  [R0402S4]  (value not drawn)
RP111  22R  [R0402S4]  (value not drawn)
TP0  TestPoint  [T_0_7]  (value not drawn)
TP1  TestPoint  [T_0_7]  (value not drawn)
TP2  TestPoint  [T_0_7]  (value not drawn)
TP3  TestPoint  [T_0_7]  (value not drawn)
TP4  TestPoint  [T_0_7]  (value not drawn)
TP5  TestPoint  [T_0_7]  (value not drawn)
TP6  TestPoint  [T_0_7]  (value not drawn)
TP7  TestPoint  [T_0_7]  (value not drawn)
TP8  TestPoint  [T_0_7]  (value not drawn)
TP9  TestPoint  [T_0_7]  (value not drawn)
TP10  TestPoint  [T_0_7]  (value not drawn)
TP11  TestPoint  [T_0_7]  (value not drawn)
TP12  TestPoint  [T_0_7]  (value not drawn)
TP13  TestPoint  [T_0_7]  (value not drawn)
TP14  TestPoint  [T_0_7]  (value not drawn)
TP15  TestPoint  [T_0_7]  (value not drawn)
TP16  TestPoint  [T_0_7]  (value not drawn)
TP17  TestPoint  [T_0_7]  (value not drawn)
TP18  TestPoint  [T_0_7]  (value not drawn)
TP19  TestPoint  [T_0_7]  (value not drawn)
U100  XC6SLX9_TOG144C  [TQFP144]  (parts A,B,C,D,E,F of 6)
U101  M25P16  [SOP-8]
X100  60MHz  [CRY_D3225]

### Ports
CPU_D0 (out), CPU_D1 (out), CPU_D2 (out), CPU_D3 (out), CPU_D4 (out), CPU_D5 (out), CPU_D6 (out), CPU_D7 (out), CPU_D8 (out), CPU_D9 (out), CPU_D10 (out), CPU_D11 (out), CPU_D12 (out), CPU_D13 (out), CPU_HSYNC (out), CPU_MOSI (in), CPU_PIXCLK (out), CPU_RST (in), CPU_SCLK (in), CPU_VSYNC (out), ISP_CLPDM (out), ISP_CLPOB (out), ISP_DCLK (out), ISP_DL0 (in), ISP_DL1 (in), ISP_DL2 (in), ISP_DL3 (in), ISP_DL4 (in), ISP_DL5 (in), ISP_DL6 (in), ISP_DL7 (in), ISP_DL8 (in), ISP_DL9 (in), ISP_DL10 (in), ISP_DL11 (in), ISP_DL12 (in), ISP_DL13 (in), ISP_DR0 (in), ISP_DR1 (in), ISP_DR2 (in), ISP_DR3 (in), ISP_DR4 (in), ISP_DR5 (in), ISP_DR6 (in), ISP_DR7 (in), ISP_DR8 (in), ISP_DR9 (in), ISP_DR10 (in), ISP_DR11 (in), ISP_DR12 (in), ISP_DR13 (in), ISP_FD (out), ISP_H1 (out), ISP_H2 (out), ISP_HD (out), ISP_HL (out), ISP_nXSG2 (out), ISP_nXV1 (out), ISP_nXV2 (out), ISP_PBLK (out), ISP_RG (out), ISP_SHD (out), ISP_SHP (out), ISP_SHUT (out), ISP_VD (out)

### Nets
1V2: C112.2 C113.2 C114.2 C115.2 C116.2 C117.2 U100.19(VCCINT) U100.28(VCCINT) U100.52(VCCINT) U100.89(VCCINT) U100.128(VCCINT)
2V5: C118.2 C119.2 C120.2 C121.2 C122.2 C123.2 U100.20(VCCAUX) U100.36(VCCAUX) U100.53(VCCAUX) U100.90(VCCAUX) U100.129(VCCAUX)
3V3: C100.2 C101.2 C102.2 C103.2 C104.2 C105.2 C106.2 C107.2 C108.2 C109.2 C110.2 C111.2 JTAG.4 R101.2 R103.2 R105.1 R110.1 R111.1 R114.2 R115.2 R116.2 R117.2 R118.2 RP101.5 RP101.6 RP101.7 RP101.8 RP102.5 RP102.6 RP102.7 U100.4(VCC_IO_3) U100.18(VCC_IO_3) U100.31(VCC_IO_3) U100.42(VCC_IO_2) U100.63(VCC_IO_2) U100.76(VCC_IO_1) U100.86(VCC_IO_1) U100.103(VCC_IO_1) U100.122(VCC_IO_0) U100.125(VCC_IO_0) U100.135(VCC_IO_0) U101.8(VCC)
SUSPEND: C100.1 C101.1 C102.1 C103.1 C104.1 C105.1 C106.1 C107.1 C108.1 C109.1 C110.1 C111.1 C112.1 C113.1 C114.1 C115.1 C116.1 C117.1 C118.1 C119.1 C120.1 C121.1 C122.1 C123.1 JTAG.2 JTAG.10 R109.1 R112.1 U100.3(GND) U100.13(GND) U100.25(GND) U100.49(GND) U100.54(GND) U100.68(GND) U100.72(CMPCS_B) U100.73(SUSPEND) U100.77(GND) U100.91(GND) U100.96(GND) U100.108(GND) U100.113(GND) U100.130(GND) U100.136(GND) U101.4(GND) X100.2(GND)  [also labelled GND]
CCLK: R108.1 U100.70(IO_L1P_CCLK)
CLK_60M: R104.2 U100.126(IO_L36N_GCLK14)
CPU_D0: RP108.3 ; port CPU_D0
CPU_D1: RP108.4 ; port CPU_D1
CPU_D2: RP109.1 ; port CPU_D2
CPU_D3: RP109.2 ; port CPU_D3
CPU_D4: RP109.3 ; port CPU_D4
CPU_D5: RP109.4 ; port CPU_D5
CPU_D6: RP110.1 ; port CPU_D6
CPU_D7: RP110.2 ; port CPU_D7
CPU_D8: RP110.3 ; port CPU_D8
CPU_D9: RP110.4 ; port CPU_D9
CPU_D10: RP111.1 ; port CPU_D10
CPU_D11: RP111.2 ; port CPU_D11
CPU_D12: RP111.3 ; port CPU_D12
CPU_D13: RP111.4 ; port CPU_D13
CPU_HSYNC: RP108.2 ; port CPU_HSYNC
CPU_MOSI: U100.29(IO_L36N) ; port CPU_MOSI
CPU_PIXCLK: R113.2 ; port CPU_PIXCLK
CPU_RST: U100.30(IO_L36P) ; port CPU_RST
CPU_SCLK: U100.27(IO_L37P) ; port CPU_SCLK
CPU_VSYNC: RP108.1 ; port CPU_VSYNC
CSO_B: RP102.3 U100.38(IO_L65N_CSO_B) U101.1(~{CS})
DIN: R106.1 U100.65(IO_L3P_DIN_MISO_MISO0)
DONE: U100.71(DONE)
FPGA_CLPDM: RP106.6 TP15.1(CMPCS_B) U100.56(IO_L30P_GCLK1)
FPGA_CLPOB: RP105.5 TP12.1(CMPCS_B) U100.50(IO_L31N_GCLK30)
FPGA_DCLK: RP105.8 TP9.1(CMPCS_B) U100.46(IO_L49P)
FPGA_DL0: U100.74(IO_L74N_DOUT_BUSY) ; port ISP_DL0  [also labelled ISP_DL0]
FPGA_DL1: U100.75(IO_L74P_AWAKE) ; port ISP_DL1  [also labelled ISP_DL1]
FPGA_DL2: U100.78(IO_L47N) ; port ISP_DL2  [also labelled ISP_DL2]
FPGA_DL3: U100.79(IO_L47P) ; port ISP_DL3  [also labelled ISP_DL3]
FPGA_DL4: U100.80(IO_L6N) ; port ISP_DL4  [also labelled ISP_DL4]
FPGA_DL5: U100.81(IO_L46P) ; port ISP_DL5  [also labelled ISP_DL5]
FPGA_DL6: U100.82(IO_L45N) ; port ISP_DL6  [also labelled ISP_DL6]
FPGA_DL7: U100.83(IO_L45P) ; port ISP_DL7  [also labelled ISP_DL7]
FPGA_DL8: U100.84(IO_L43N_GCLK4) ; port ISP_DL8  [also labelled ISP_DL8]
FPGA_DL9: U100.85(IO_L43P_GCLK5) ; port ISP_DL9  [also labelled ISP_DL9]
FPGA_DL10: U100.87(IO_L42N_GCLK6_TRDY1) ; port ISP_DL10  [also labelled ISP_DL10]
FPGA_DL11: U100.88(IO_L42P_GCLK7) ; port ISP_DL11  [also labelled ISP_DL11]
FPGA_DL12: U100.92(IO_L41N_GCLK8) ; port ISP_DL12  [also labelled ISP_DL12]
FPGA_DL13: U100.93(IO_L41P_GCLK9_IRDY) ; port ISP_DL13  [also labelled ISP_DL13]
FPGA_DR0: U100.94(IO_L40N_GCLK10) ; port ISP_DR0  [also labelled ISP_DR0]
FPGA_DR1: U100.95(IO_L40P_GCLK11) ; port ISP_DR1  [also labelled ISP_DR1]
FPGA_DR2: U100.97(IO_L34N) ; port ISP_DR2  [also labelled ISP_DR2]
FPGA_DR3: U100.98(IO_L34P) ; port ISP_DR3  [also labelled ISP_DR3]
FPGA_DR4: U100.99(IO_L33N) ; port ISP_DR4  [also labelled ISP_DR4]
FPGA_DR5: U100.100(IO_L33P) ; port ISP_DR5  [also labelled ISP_DR5]
FPGA_DR6: U100.101(IO_L32N) ; port ISP_DR6  [also labelled ISP_DR6]
FPGA_DR7: U100.102(IO_L32P) ; port ISP_DR7  [also labelled ISP_DR7]
FPGA_DR8: U100.104(IO_L66N) ; port ISP_DR8  [also labelled ISP_DR8]
FPGA_DR9: U100.105(IO_L66P) ; port ISP_DR9  [also labelled ISP_DR9]
FPGA_DR10: U100.111(IO_L66N) ; port ISP_DR10  [also labelled ISP_DR10]
FPGA_DR11: U100.112(IO_L66P) ; port ISP_DR11  [also labelled ISP_DR11]
FPGA_DR12: U100.114(IO_L65N) ; port ISP_DR12  [also labelled ISP_DR12]
FPGA_DR13: U100.115(IO_L65P) ; port ISP_DR13  [also labelled ISP_DR13]
FPGA_FD: RP107.8 TP4.1(CMPCS_B) U100.121(IO_L62P)
FPGA_H1: RP103.7 TP1.1(CMPCS_B) U100.118(IO_L63N)
FPGA_H2: RP103.6 TP2.1(CMPCS_B) U100.119(IO_L63P)
FPGA_HD: RP105.7 TP10.1(CMPCS_B) U100.47(IO_L48N_RDWR_VREF)
FPGA_HL: RP103.8 TP0.1(CMPCS_B) U100.117(IO_L64P)
FPGA_nXSG2: RP104.6 TP8.1(CMPCS_B) U100.45(IO_L49N)
FPGA_nXV1: RP104.8 TP6.1(CMPCS_B) U100.43(IO_L62N)
FPGA_nXV2: RP104.7 TP7.1(CMPCS_B) U100.44(IO_L62P)
FPGA_PBLK: RP105.6 TP11.1(CMPCS_B) U100.48(IO_L48P)
FPGA_RG: RP103.5 TP3.1(CMPCS_B) U100.120(IO_L62N_VREF)
FPGA_SHD: RP106.7 TP14.1(CMPCS_B) U100.55(IO_L30N_GCLK0_USERCCLK)
FPGA_SHP: RP106.8 TP13.1(CMPCS_B) U100.51(IO_L31P_GCLK31)
FPGA_SHUT: RP107.5 TP5.1(CMPCS_B) U100.123(IO_L37N_GCLK12)
FPGA_VD: RP106.5 TP16.1(CMPCS_B) U100.57(IO_L14N)
HSWAPEN: R111.2 R112.2 U100.144(IO_L1P_HSWAPEN)
INIT_B: D101.2(K) R101.1 U100.39(IO_L66N_INT_B)
ISP_CLPDM: RP106.3 ; port ISP_CLPDM
ISP_CLPOB: RP105.4 ; port ISP_CLPOB
ISP_DCLK: RP105.1 ; port ISP_DCLK
ISP_FD: RP107.1 ; port ISP_FD
ISP_H1: RP103.2 ; port ISP_H1
ISP_H2: RP103.3 ; port ISP_H2
ISP_HD: RP105.2 ; port ISP_HD
ISP_HL: RP103.1 ; port ISP_HL
ISP_nXSG2: RP104.3 ; port ISP_nXSG2
ISP_nXV1: RP104.1 ; port ISP_nXV1
ISP_nXV2: RP104.2 ; port ISP_nXV2
ISP_PBLK: RP105.3 ; port ISP_PBLK
ISP_RG: RP103.4 ; port ISP_RG
ISP_SHD: RP106.2 ; port ISP_SHD
ISP_SHP: RP106.1 ; port ISP_SHP
ISP_SHUT: RP107.4 ; port ISP_SHUT
ISP_VD: RP106.4 ; port ISP_VD
LED_0: D102.2(K) U100.137(IO_L4N)
LED_1: D103.2(K) U100.138(IO_L4P)
LED_2: D104.2(K) U100.139(IO_L3N)
LED_3: D105.2(K) U100.140(IO_L3P)
M0: R110.2 U100.69(OP_L1N_M0_CMPMISO)
M1: R109.2 U100.60(IO_L13P_M1)
MOSI: R107.1 U100.64(IO_L3N_MOSI_CSI_B_MISO1)
O_D0: RP108.6 U100.8(IO_L51P)
O_D1: RP108.5 U100.9(IO_L50N)
O_D2: RP109.8 U100.10(IO_L50P)
O_D3: RP109.7 U100.11(IO_L49N)
O_D4: RP109.6 U100.12(IO_L49P)
O_D5: RP109.5 U100.14(IO_L44N_GCLK20)
O_D6: RP110.8 U100.15(IO_L44P_GCLK21)
O_D7: RP110.7 U100.16(IO_L43N_GCLK22_IRDY2)
O_D8: RP110.6 U100.17(IO_L43P_GCLK23)
O_D9: RP110.5 U100.21(IO_L42N_GCLK24)
O_D10: RP111.8 U100.22(IO_L42P_GCLK25_TRDY2)
O_D11: RP111.7 U100.23(IO_L41N_GCLK26)
O_D12: RP111.6 U100.24(IO_L41P_GCLK27)
O_D13: RP111.5 U100.26(IO_L37N)
O_HSYNC: RP108.7 TP19.1(CMPCS_B) U100.7(IO_L51N)
O_PIXCLK: R113.1 TP17.1(CMPCS_B) U100.5(IO_L52N)
O_VSYNC: RP108.8 TP18.1(CMPCS_B) U100.6(IO_L52P)
PROGRAM_B: R118.1 U100.37(PROGRAM_B)
TCK: JTAG.1 RP101.4 U100.109(TCK)
TDI: JTAG.9 RP101.1 U100.110(TDI)
TDO: JTAG.3 RP101.3 U100.106(TDO)
TMS: JTAG.5 RP101.2 U100.107(TMS)
NetD101_1: D101.1(A) R103.1
NetD102_1: D102.1(A) R114.1
NetD103_1: D103.1(A) R115.1
NetD104_1: D104.1(A) R116.1
NetD105_1: D105.1(A) R117.1
NetR104_1: R104.1 X100.3(CLK)
NetR105_2: R105.2 X100.4(VDD)
NetR106_2: R106.2 U101.2(DO)
NetR107_2: R107.2 U101.5(DIO)
NetR108_2: R108.2 U101.6(CLK)
NetRP102_2: RP102.2 U101.3(~{WP})
NetRP102_4: RP102.4 U101.7(~{HOLD})

Not connected (* = marked no-connect by the designer): JTAG 6* 7* 8*; RP102 1* 8*; RP104 4* 5*; RP107 2* 3* 6* 7*; U100 1(IO_L83N_VREF) 2(IO_L83P) 32(IO_L2N) 33(IO_L2P) 34(IO_L1N_VREF) 35(IO_L1P) 40(IO_L64N) 41(IO_L64P) 58(IO_L14P) 59(IO_L13N) 61(IO_L12N_MISO3) 62(IO_L12P_MISO2) 66(IO_L2N_CMPMOSI) 67(IO_L2P_CMPCLK) 116(IO_L64N) 124(IO_L37P_GCLK13) 127(IO_L36P_GCLK15) 131(IO_L35N_GCLK16) 132(IO_L35P_GCLK17) 133(IO_L34N_GCLK18) 134(IO_L34P_GCLK19) 141(IO_L2N) 142(IO_L2P) 143(IO_L1N+VREF); X100 1(E/D)

### Library data of the parts
C100-C123 = Cap Semi: as C300 on sheet CCD; Published: 8-Jun-2000; LatestRevisionDate: 29-May-2009; LatestRevisionNote: IPC-7351 Footprint Added.; PackageReference: C1206; Publisher: Altium Limited; PackageDescription: Chip Capacitor
D101-D105 = SMDLED: Typical RED, GREEN, YELLOW, AMBER GaAs LED; Published: 8-Jun-2000; LatestRevisionDate: 17-Jul-2002; LatestRevisionNote: Re-released for DXP Platform.; PackageVersion: Feb-2002; PackageReference: 3.2X1.6X1.1; Publisher: Altium Limited; PackageDescription: SM LED; 2 Flat Leads
JTAG = Header 5X2: Header, 5-Pin, Dual row; LatestRevisionDate: 17-Jul-2002; LatestRevisionNote: Re-released for DXP Platform.; Publisher: Altium Limited
R101 R103-R118 = Res3: Resistor; Value: 1K; Published: 8-Jun-2000; LatestRevisionDate: 29-May-2009; LatestRevisionNote: IPC-7351 Footprint Added.; PackageReference: J1-0603; Publisher: Altium Limited; PackageDescription: Chip Resistor
RP101-RP111 = ResPack: Isolated Resistor Network; Value: 1K; Published: 24-Mar-1999; LatestRevisionDate: 29-May-2009; LatestRevisionNote: IPC-7351 Footprint Added.; PackageReference: SO-16; Publisher: Altium Limited; PackageDescription: 16-Pin Small Outline Integrated Circuit 1.27 mm Pitch; Code_JEDEC: MS-012-AC; Code_IPC: SOIC127P600-16
U101 = W25X16
X100 = XTAL_5X7

## Sheet CPU.SchDoc
size A3
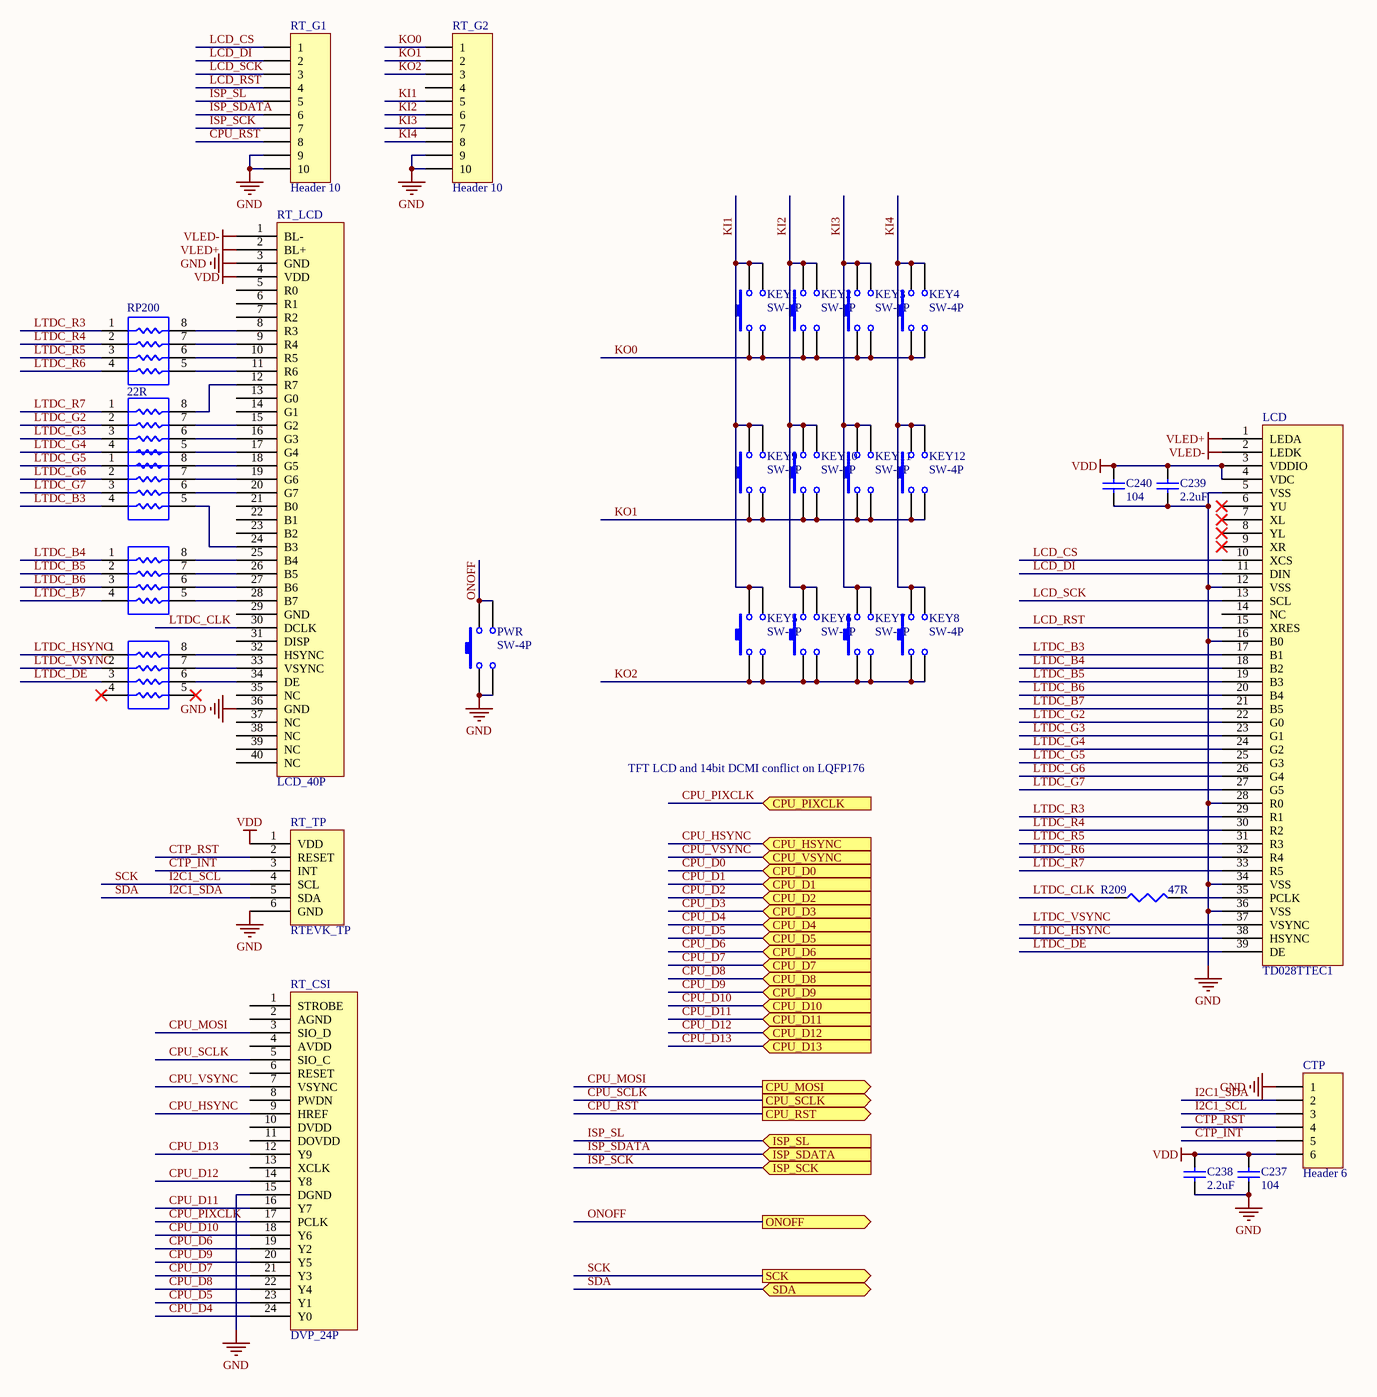
[diagram p3: CPU.SchDoc]

### Parts
C237  104  [C0402]
C238  2.2uF  [C0603]
C239  2.2uF  [C0603]
C240  104  [C0402]
CTP  Header 6  [CTP]
KEY1  SW-4P  [KEY-4P]
KEY2  SW-4P  [KEY-4P]
KEY3  SW-4P  [KEY-4P]
KEY4  SW-4P  [KEY-4P]
KEY5  SW-4P  [KEY-4P]
KEY6  SW-4P  [KEY-4P]
KEY7  SW-4P  [KEY-4P]
KEY8  SW-4P  [KEY-4P]
KEY9  SW-4P  [KEY-4P]
KEY10  SW-4P  [KEY-4P]
KEY11  SW-4P  [KEY-4P]
KEY12  SW-4P  [KEY-4P]
LCD  TD028TTEC1  [FPC_39]
PWR  SW-4P  [KEY-4P]
R209  47R  [R0603]
RP200  22R  [R0402S4]
RP201  22R  [R0402S4]  (value not drawn)
RP202  22R  [R0402S4]  (value not drawn)
RP203  22R  [R0402S4]  (value not drawn)
RP204  22R  [R0402S4]  (value not drawn)
RT_CSI  DVP_24P  [24PIN-0.5MM]
RT_G1  Header 10  [HEADER10]
RT_G2  Header 10  [HEADER10]
RT_LCD  LCD_40P  [40PIN-0.5MM]
RT_TP  RTEVK_TP  [CTP]

### Ports
CPU_D0 (in), CPU_D1 (in), CPU_D2 (in), CPU_D3 (in), CPU_D4 (in), CPU_D5 (in), CPU_D6 (in), CPU_D7 (in), CPU_D8 (in), CPU_D9 (in), CPU_D10 (in), CPU_D11 (in), CPU_D12 (in), CPU_D13 (in), CPU_HSYNC (in), CPU_MOSI (out), CPU_PIXCLK (in), CPU_RST (out), CPU_SCLK (out), CPU_VSYNC (in), ISP_SCK (in), ISP_SDATA (in), ISP_SL (in), ONOFF (out), SCK (out), SDA (bidir)

### Nets
GND: C237.1 C238.1 C239.1 C240.1 CTP.1 LCD.5(VSS) LCD.12(VSS) LCD.16(B0) LCD.28(R0) LCD.34(VSS) LCD.36(VSS) PWR.1 PWR.3 RT_CSI.15(DGND) RT_G1.9 RT_G1.10 RT_G2.9 RT_G2.10 RT_LCD.3(GND) RT_LCD.36(GND) RT_TP.6(GND)  [project net SUSPEND]
VDD: C237.2 C238.2 C239.2 C240.2 CTP.6 LCD.3(VDDIO) LCD.4(VDC) RT_LCD.4(VDD) RT_TP.1(VDD)
VLED+: LCD.1(LEDA) RT_LCD.2(BL+)
VLED-: LCD.2(LEDK) RT_LCD.1(BL-)
CPU_D4: RT_CSI.24(Y0) ; port CPU_D4
CPU_D5: RT_CSI.23(Y1) ; port CPU_D5
CPU_D6: RT_CSI.19(Y2) ; port CPU_D6
CPU_D7: RT_CSI.21(Y3) ; port CPU_D7
CPU_D8: RT_CSI.22(Y4) ; port CPU_D8
CPU_D9: RT_CSI.20(Y5) ; port CPU_D9
CPU_D10: RT_CSI.18(Y6) ; port CPU_D10
CPU_D11: RT_CSI.16(Y7) ; port CPU_D11
CPU_D12: RT_CSI.14(Y8) ; port CPU_D12
CPU_D13: RT_CSI.12(Y9) ; port CPU_D13
CPU_HSYNC: RT_CSI.9(HREF) ; port CPU_HSYNC
CPU_MOSI: RT_CSI.3(SIO_D) ; port CPU_MOSI
CPU_PIXCLK: RT_CSI.17(PCLK) ; port CPU_PIXCLK
CPU_RST: RT_G1.8 ; port CPU_RST
CPU_SCLK: RT_CSI.5(SIO_C) ; port CPU_SCLK
CPU_VSYNC: RT_CSI.7(VSYNC) ; port CPU_VSYNC
CTP_INT: CTP.5 RT_TP.3(INT)
CTP_RST: CTP.4 RT_TP.2(RESET)
I2C1_SCL: CTP.3 RT_TP.4(SCL) ; port SCK  [also labelled SCK]
I2C1_SDA: CTP.2 RT_TP.5(SDA) ; port SDA  [also labelled SDA]
ISP_SCK: RT_G1.7 ; port ISP_SCK
ISP_SDATA: RT_G1.6 ; port ISP_SDATA
ISP_SL: RT_G1.5 ; port ISP_SL
KI1: KEY1.2 KEY1.4 KEY5.2 KEY5.4 KEY9.2 KEY9.4 RT_G2.5
KI2: KEY2.2 KEY2.4 KEY6.2 KEY6.4 KEY10.2 KEY10.4 RT_G2.6
KI3: KEY3.2 KEY3.4 KEY7.2 KEY7.4 KEY11.2 KEY11.4 RT_G2.7
KI4: KEY4.2 KEY4.4 KEY8.2 KEY8.4 KEY12.2 KEY12.4 RT_G2.8
KO0: KEY1.1 KEY1.3 KEY2.1 KEY2.3 KEY3.1 KEY3.3 KEY4.1 KEY4.3 RT_G2.1
KO1: KEY9.1 KEY9.3 KEY10.1 KEY10.3 KEY11.1 KEY11.3 KEY12.1 KEY12.3 RT_G2.2
KO2: KEY5.1 KEY5.3 KEY6.1 KEY6.3 KEY7.1 KEY7.3 KEY8.1 KEY8.3 RT_G2.3
LCD_CS: LCD.10(XCS) RT_G1.1
LCD_DI: LCD.11(DIN) RT_G1.2
LCD_RST: LCD.15(XRES) RT_G1.4
LCD_SCK: LCD.13(SCL) RT_G1.3
LTDC_B3: LCD.17(B1) RP202.4
LTDC_B4: LCD.18(B2) RP203.1
LTDC_B5: LCD.19(B3) RP203.2
LTDC_B6: LCD.20(B4) RP203.3
LTDC_B7: LCD.21(B5) RP203.4
LTDC_CLK: R209.1 RT_LCD.30(DCLK)
LTDC_DE: LCD.39(DE) RP204.3
LTDC_G2: LCD.22(G0) RP201.2
LTDC_G3: LCD.23(G1) RP201.3
LTDC_G4: LCD.24(G2) RP201.4
LTDC_G5: LCD.25(G3) RP202.1
LTDC_G6: LCD.26(G4) RP202.2
LTDC_G7: LCD.27(G5) RP202.3
LTDC_HSYNC: LCD.38(HSYNC) RP204.1
LTDC_R3: LCD.29(R1) RP200.1
LTDC_R4: LCD.30(R2) RP200.2
LTDC_R5: LCD.31(R3) RP200.3
LTDC_R6: LCD.32(R4) RP200.4
LTDC_R7: LCD.33(R5) RP201.1
LTDC_VSYNC: LCD.37(VSYNC) RP204.2
ONOFF: PWR.2 PWR.4 ; port ONOFF
NetLCD_35: LCD.35(PCLK) R209.2
NetRP200_5: RP200.5 RT_LCD.11(R6)
NetRP200_6: RP200.6 RT_LCD.10(R5)
NetRP200_7: RP200.7 RT_LCD.9(R4)
NetRP200_8: RP200.8 RT_LCD.8(R3)
NetRP201_5: RP201.5 RT_LCD.17(G4)
NetRP201_6: RP201.6 RT_LCD.16(G3)
NetRP201_7: RP201.7 RT_LCD.15(G2)
NetRP201_8: RP201.8 RT_LCD.12(R7)
NetRP202_5: RP202.5 RT_LCD.24(B3)
NetRP202_6: RP202.6 RT_LCD.20(G7)
NetRP202_7: RP202.7 RT_LCD.19(G6)
NetRP202_8: RP202.8 RT_LCD.18(G5)
NetRP203_5: RP203.5 RT_LCD.28(B7)
NetRP203_6: RP203.6 RT_LCD.27(B6)
NetRP203_7: RP203.7 RT_LCD.26(B5)
NetRP203_8: RP203.8 RT_LCD.25(B4)
NetRP204_6: RP204.6 RT_LCD.34(DE)
NetRP204_7: RP204.7 RT_LCD.33(VSYNC)
NetRP204_8: RP204.8 RT_LCD.32(HSYNC)

Not connected (* = marked no-connect by the designer): LCD 6(YU)* 7(XL)* 8(YL)* 9(XR)* 14(NC); RP204 4* 5*; RT_CSI 1(STROBE) 2(AGND) 4(AVDD) 6(RESET) 8(PWDN) 10(DVDD) 11(DOVDD) 13(XCLK); RT_G2 4; RT_LCD 5(R0) 6(R1) 7(R2) 13(G0) 14(G1) 21(B0) 22(B1) 23(B2) 29(GND) 31(DISP) 35(NC) 37(NC) 38(NC) 39(NC) 40(NC)

### Notes on the sheet
- TFT LCD and 14bit DCMI conflict on LQFP176

### Library data of the parts
C237-C240 = Cap Semi: as C300 on sheet CCD; Published: 8-Jun-2000; LatestRevisionDate: 29-May-2009; LatestRevisionNote: IPC-7351 Footprint Added.; PackageReference: C1206; Publisher: Altium Limited; PackageDescription: Chip Capacitor
CTP = Header 6: Header, 6-Pin; LatestRevisionDate: 17-Jul-2002; LatestRevisionNote: Re-released for DXP Platform.; Publisher: Altium Limited
KEY1-KEY12 PWR = SW-4P: Switch; Published: 24-Mar-1999; LatestRevisionDate: 17-Jul-2002; LatestRevisionNote: Re-released for DXP Platform.; PackageReference: SPST-2; Publisher: Altium Limited; PackageDescription: Switch; 2 Leads
R209 = Res3: Resistor; Value: 1K; Published: 8-Jun-2000; LatestRevisionDate: 29-May-2009; LatestRevisionNote: IPC-7351 Footprint Added.; PackageReference: J1-0603; Publisher: Altium Limited; PackageDescription: Chip Resistor
RP200-RP204 = ResPack: Isolated Resistor Network; Value: 1K; Published: 24-Mar-1999; LatestRevisionDate: 29-May-2009; LatestRevisionNote: IPC-7351 Footprint Added.; PackageReference: SO-16; Publisher: Altium Limited; PackageDescription: 16-Pin Small Outline Integrated Circuit 1.27 mm Pitch; Code_JEDEC: MS-012-AC; Code_IPC: SOIC127P600-16
RT_G1 RT_G2 = Header 10: Header, 10-Pin; LatestRevisionDate: 17-Jul-2002; LatestRevisionNote: Re-released for DXP Platform.; Publisher: Altium Limited

## Sheet Power.SchDoc
size A4
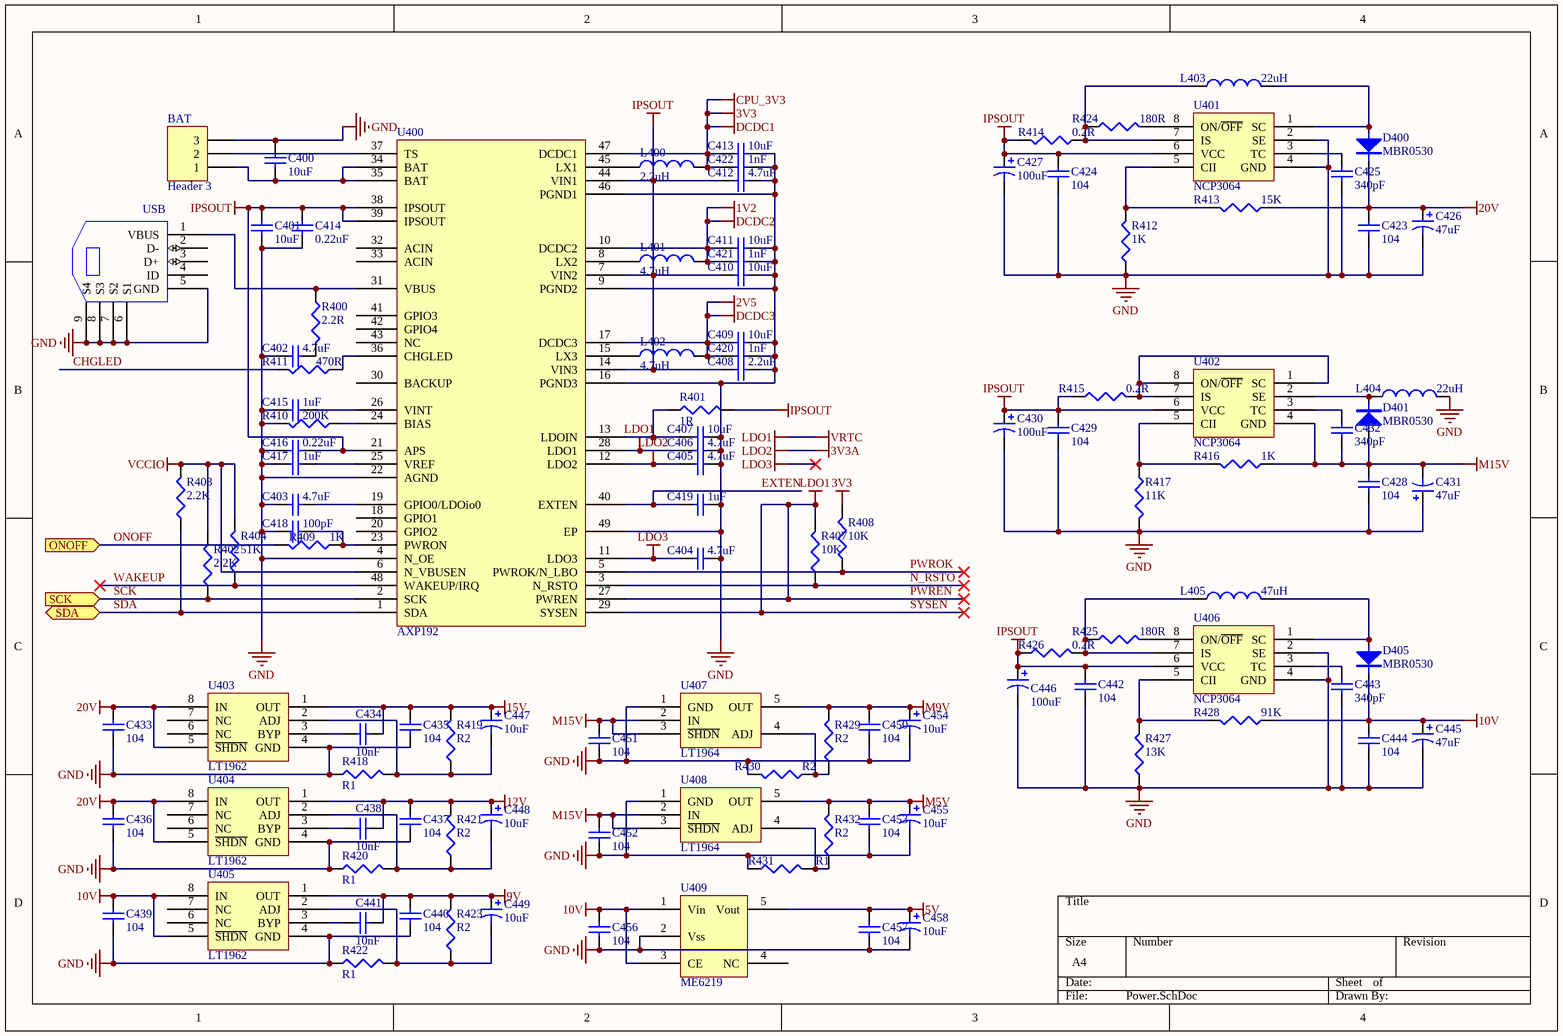
[diagram p4: Power.SchDoc]

### Parts
BAT  Header 3  [LBAT]
C400  10uF  [C0805]
C401  10uF  [C0805]
C402  4.7uF  [C0805]
C403  4.7uF  [C0805]
C404  4.7uF  [C0805]
C405  4.7uF  [C0805]
C406  4.7uF  [C0805]
C407  10uF  [C0805]
C408  2.2uF  [C0805]
C409  10uF  [C0805]
C410  10uF  [C0805]
C411  10uF  [C0805]
C412  4.7uF  [C0805]
C413  10uF  [C0805]
C414  0.22uF  [C0603]
C415  1uF  [C0603]
C416  0.22uF  [C0603]
C417  1uF  [C0603]
C418  100pF  [C0603]
C419  1uF  [C0603]
C420  1nF  [C0603]
C421  1nF  [C0603]
C422  1nF  [C0603]
C423  104  [C0402]
C424  104  [C0402]
C425  340pF  [C0402]
C426  47uF  [7343]
C427  100uF  [C0805]
C428  104  [C0402]
C429  104  [C0402]
C430  100uF  [C0805]
C431  47uF  [7343]
C432  340pF  [C0805]
C433  104  [C0402]
C434  10nF  [C0402]
C435  104  [C0402]
C436  104  [C0402]
C437  104  [C0402]
C438  10nF  [C0402]
C439  104  [C0402]
C440  104  [C0402]
C441  10nF  [C0402]
C442  104  [C0402]
C443  340pF  [C0402]
C444  104  [C0402]
C445  47uF  [7343]
C446  100uF  [C0805]
C447  10uF  [7343]
C448  10uF  [7343]
C449  10uF  [7343]
C450  104  [C0402]
C451  104  [C0402]
C452  104  [C0402]
C453  104  [C0402]
C454  10uF  [7343]
C455  10uF  [7343]
C456  104  [C0402]
C457  104  [C0402]
C458  10uF  [7343]
D400  MBR0530  [SOD123]
D401  MBR0530  [SOD123]
D405  MBR0530  [SOD123]
L400  2.2uH  [IND_4X4]
L401  4.7uH  [IND_4X4]
L402  4.7uH  [IND_4X4]
L403  22uH  [IND_4X4]
L404  22uH  [IND_4X4]
L405  47uH  [IND_4X4]
R400  2.2R  [R0603]
R401  1R  [R0805]
R402  2.2K  [R0603]
R403  2.2K  [R0603]
R404  51K  [R0603]
R407  10K  [R0603]
R408  10K  [R0603]
R409  1K  [R0603]
R410  200K  [R0603]
R411  470R  [R0603]
R412  1K  [R0603]
R413  15K  [R0603]
R414  0.2R  [R0805]
R415  0.2R  [R0805]
R416  1K  [R0603]
R417  11K  [R0603]
R418  R1  [R0603]
R419  R2  [R0603]
R420  R1  [R0603]
R421  R2  [R0603]
R422  R1  [R0603]
R423  R2  [R0603]
R424  180R  [R0603]
R425  180R  [R0603]
R426  0.2R  [R0805]
R427  13K  [R0603]
R428  91K  [R0603]
R429  R2  [R0603]
R430  R2  [R0603]
R431  R1  [R0603]
R432  R2  [R0603]
U400  AXP192  [QFN-48]
U401  NCP3064  [SOP-8]
U402  NCP3064  [SOP-8]
U403  LT1962  [MS8]
U404  LT1962  [MS8]
U405  LT1962  [MS8]
U406  NCP3064  [SOP-8]
U407  LT1964  [SOT25]
U408  LT1964  [SOT25]
U409  ME6219  [SOT25]
USB  USB-MICRO  [HUM011D-5-S]  (value not drawn)

### Ports
ONOFF (in), SCK (in), SDA (bidir)

### Nets
1V2: C411.1 C421.2 L401.2 U400.10(DCDC2)  [also labelled DCDC2]
2V5: C409.1 C420.2 L402.2 U400.17(DCDC3)  [also labelled DCDC3]
3V3: C413.1 C422.2 L400.2 R408.2 U400.47(DCDC1)  [also labelled CPU_3V3, DCDC1]
3V3A: C405.1 U400.12(LDO2)  [also labelled LDO2]
5V: C457.2 C458.1 U409.5(Vout)
9V: C440.2 C441.1 C449.1 R423.2 U405.1(OUT)
10V: C439.2 C444.1 C445.1 C456.2 D405.2 R428.1 U405.5(~{SHDN}) U405.8(IN) U409.1(Vin) U409.3(CE)
12V: C437.1 C438.2 C448.1 R421.2 U404.1(OUT)  [project net CCD_RD]
15V: C434.1 C435.1 C447.1 R419.2 U403.1(OUT)
20V: C423.2 C426.1 C433.2 C436.1 D400.2 R413.1 U403.5(~{SHDN}) U403.8(IN) U404.5(~{SHDN}) U404.8(IN)
GND: BAT.3 C400.2 C401.1 C402.2 C403.1 C404.1 C405.2 C406.2 C407.2 C408.2 C409.2 C410.2 C411.2 C412.2 C413.2 C414.1 C415.2 C416.2 C417.2 C418.2 C419.1 C420.1 C421.1 C422.1 C423.1 C424.1 C425.1 C426.2 C427.2 C428.1 C429.1 C430.2 C431.1 C433.1 C435.2 C436.2 C437.2 C439.1 C440.1 C442.2 C443.2 C444.2 C445.2 C446.2 C450.1 C451.1 C452.1 C453.1 C454.2 C455.2 C456.1 C457.1 C458.2 L404.2 R410.2 R412.1 R417.2 R418.1 R420.1 R422.1 R427.1 R430.2 R431.1 U400.4(N_OE) U400.9(PGND2) U400.16(PGND3) U400.22(AGND) U400.46(PGND1) U400.49(EP) U401.2(SE) U401.4(GND) U403.4(GND) U404.4(GND) U405.4(GND) U406.2(SE) U406.4(GND) U407.1(GND) U408.1(GND) U409.2(Vss) USB.5(GND) USB.6(S1) USB.7(S2) USB.8(S3) USB.9(S4)  [project net SUSPEND]
IPSOUT: C401.2 C408.1 C410.1 C412.1 C414.2 C416.1 C424.2 C427.1 C429.2 C430.1 C442.1 C446.1 R401.2 R414.2 R415.1 R426.1 U400.7(VIN2) U400.14(VIN3) U400.21(APS) U400.38(IPSOUT) U400.39(IPSOUT) U400.44(VIN1) U401.6(VCC) U402.6(VCC) U406.6(VCC)
LDO3: C404.2 U400.11(LDO3)
M5V: C453.2 C455.1 R432.2 U408.5(OUT)
M9V: C450.2 C454.1 R429.2 U407.5(OUT)
M15V: C428.2 C431.2 C432.1 C451.2 C452.2 D401.1 R416.1 U402.4(GND) U407.2(IN) U407.3(~{SHDN}) U408.2(IN) U408.3(~{SHDN})
PWREN: C406.1 R407.2 U400.27(PWREN) U400.28(LDO1) U400.29(SYSEN)  [also labelled LDO1, SYSEN, VRTC]
VCCIO: R402.2 R403.2 R404.2 U400.6(N_VBUSEN)
CHGLED: R411.2
EXTEN: C419.2 U400.40(EXTEN)
N_RSTO: R407.1 U400.3(N_RSTO)
ONOFF: R409.2 ; port ONOFF
PWROK: R408.1 U400.5(PWROK/N_LBO)
SCK: R402.1 U400.2(SCK) ; port SCK  [project net I2C1_SCL]
SDA: R403.1 U400.1(SDA) ; port SDA  [project net I2C1_SDA]
WAKEUP: R404.1 U400.48(WAKEUP/IRQ)
NetBAT_1: BAT.1 C400.1 U400.34(BAT) U400.35(BAT)
NetBAT_2: BAT.2 U400.37(TS)
NetC402_1: C402.1 R400.2
NetC403_2: C403.2 U400.19(GPIO0/LDOio0)
NetC407_1: C407.1 R401.1 U400.13(LDOIN)
NetC415_1: C415.1 U400.26(VINT)
NetC417_1: C417.1 U400.25(VREF)
NetC418_1: C418.1 R409.1 U400.23(PWRON)
NetC425_2: C425.2 U401.3(TC)
NetC432_2: C432.2 U402.3(TC)
NetC434_2: C434.2 U403.3(BYP)
NetC438_1: C438.1 U404.3(BYP)
NetC441_2: C441.2 U405.3(BYP)
NetC443_1: C443.1 U406.3(TC)
NetC447_2: C447.2 R418.2 R419.1 U403.2(ADJ)
NetC448_2: C448.2 R420.2 R421.1 U404.2(ADJ)
NetC449_2: C449.2 R422.2 R423.1 U405.2(ADJ)
NetD400_1: D400.1 L403.2 U401.1(SC)
NetD401_2: D401.2 L404.1 U402.2(SE)
NetD405_1: D405.1 L405.2 U406.1(SC)
NetL400_1: L400.1 U400.45(LX1)
NetL401_1: L401.1 U400.8(LX2)
NetL402_1: L402.1 U400.15(LX3)
NetL403_1: L403.1 R414.1 R424.1 U401.7(IS)
NetL405_1: L405.1 R425.1 R426.2 U406.7(IS)
NetR400_1: R400.1 U400.31(VBUS) USB.1(VBUS)
NetR410_1: R410.1 U400.24(BIAS)
NetR411_1: R411.1 U400.36(CHGLED)
NetR412_2: R412.2 R413.2 U401.5(CII)
NetR415_2: R415.2 U402.1(SC) U402.7(IS) U402.8(ON/~{OFF})
NetR416_2: R416.2 R417.1 U402.5(CII)
NetR424_2: R424.2 U401.8(ON/~{OFF})
NetR425_2: R425.2 U406.8(ON/~{OFF})
NetR427_2: R427.2 R428.2 U406.5(CII)
NetR429_1: R429.1 R430.1 U407.4(ADJ)
NetR431_2: R431.2 R432.1 U408.4(ADJ)

Not connected (* = marked no-connect by the designer): U400 18(GPIO1) 20(GPIO2) 30(BACKUP) 32(ACIN) 33(ACIN) 41(GPIO3) 42(GPIO4) 43(NC); U403 6(NC) 7(NC); U404 6(NC) 7(NC); U405 6(NC) 7(NC); U409 4(NC); USB 2(D-) 3(D+) 4(ID)

### Library data of the parts
BAT = Header 3: Header, 3-Pin; LatestRevisionDate: 17-Jul-2002; LatestRevisionNote: Re-released for DXP Platform.; Publisher: Altium Limited
C400-C417 C419-C425 C428 C429 C432-C444 C450-C453 C456 C457 = Cap Semi: as C300 on sheet CCD; Published: 8-Jun-2000; LatestRevisionDate: 29-May-2009; LatestRevisionNote: IPC-7351 Footprint Added.; PackageReference: C1206; Publisher: Altium Limited; PackageDescription: Chip Capacitor
C418 = Cap Semi: Capacitor (Semiconductor SIM Model); Published: 8-Jun-2000; LatestRevisionDate: 29-May-2009; LatestRevisionNote: IPC-7351 Footprint Added.; PackageReference: C1206; Publisher: Altium Limited; PackageDescription: Chip Capacitor; Value: 100pF
C426 C427 C430 C431 C445-C449 C454 C455 C458 = Cap Pol1: Polarized Capacitor (Radial); Value: 100pF; Published: 8-Jun-2000; LatestRevisionDate: 17-Jul-2002; LatestRevisionNote: Re-released for DXP Platform.; PackageReference: RB7.6-15; Publisher: Altium Limited; PackageDescription: Polarized Capacitor (Radial); 2 Leads
L400-L405 = Inductor: Code_IEC: 1005; Value: 10mH; Published: 8-Jun-2000; LatestRevisionDate: 29-May-2009; LatestRevisionNote: IPC-7351 Footprint Added.; PackageReference: 0402-A; Publisher: Altium Limited; PackageDescription: Chip Inductor; Code_JEITA: 0402
R400-R404 R407 R408 R410 R411 R413-R415 R417-R432 = Res3: Resistor; Value: 1K; Published: 8-Jun-2000; LatestRevisionDate: 29-May-2009; LatestRevisionNote: IPC-7351 Footprint Added.; PackageReference: J1-0603; Publisher: Altium Limited; PackageDescription: Chip Resistor
R409 R412 R416 = Res3: Resistor; Published: 8-Jun-2000; LatestRevisionDate: 29-May-2009; LatestRevisionNote: IPC-7351 Footprint Added.; PackageReference: J1-0603; Publisher: Altium Limited; PackageDescription: Chip Resistor; Value: 1K
USB = USB-MICRO: PCB DECAL: HIROSE-US60B-MB-5ST; Source_Path: Z:\ORCAD\CONNECTOR.OLB; Value: miniAB

## Nets that join several sheets
1V2: FPGA (11 pins), Power (C411.1 C421.2 L401.2 U400.10)
2V5: FPGA (11 pins), Power (C409.1 C420.2 L402.2 U400.17)
3V3: FPGA (42 pins), Power (5 pins)
3V3A: CCD (22 pins), Power (C405.1 U400.12)
5V: CCD (8 pins), Power (C457.2 C458.1 U409.5)
9V: CCD (9 pins), Power (5 pins)
15V: CCD (9 pins), Power (5 pins)
20V: CCD (C344.1 C348.1 Q303.2 R322.2), Power (10 pins)
CCD_RD: CCD (5 pins), Power (5 pins)
M5V: CCD (18 pins), Power (C453.2 C455.1 R432.2 U408.5)
M9V: CCD (7 pins), Power (C450.2 C454.1 R429.2 U407.5)
M15V: CCD (C346.1 C350.1 Q305.2 R321.2), Power (12 pins)
SUSPEND: CCD (88 pins), FPGA (45 pins), CPU (21 pins), Power (84 pins)
CPU_D4: FPGA (RP109.3), CPU (RT_CSI.24)
CPU_D5: FPGA (RP109.4), CPU (RT_CSI.23)
CPU_D6: FPGA (RP110.1), CPU (RT_CSI.19)
CPU_D7: FPGA (RP110.2), CPU (RT_CSI.21)
CPU_D8: FPGA (RP110.3), CPU (RT_CSI.22)
CPU_D9: FPGA (RP110.4), CPU (RT_CSI.20)
CPU_D10: FPGA (RP111.1), CPU (RT_CSI.18)
CPU_D11: FPGA (RP111.2), CPU (RT_CSI.16)
CPU_D12: FPGA (RP111.3), CPU (RT_CSI.14)
CPU_D13: FPGA (RP111.4), CPU (RT_CSI.12)
CPU_HSYNC: FPGA (RP108.2), CPU (RT_CSI.9)
CPU_MOSI: FPGA (U100.29), CPU (RT_CSI.3)
CPU_PIXCLK: FPGA (R113.2), CPU (RT_CSI.17)
CPU_RST: FPGA (U100.30), CPU (RT_G1.8)
CPU_SCLK: FPGA (U100.27), CPU (RT_CSI.5)
CPU_VSYNC: FPGA (RP108.1), CPU (RT_CSI.7)
FPGA_DL0: CCD (RP1.8), FPGA (U100.74)
FPGA_DL1: CCD (RP1.7), FPGA (U100.75)
FPGA_DL2: CCD (RP1.6), FPGA (U100.78)
FPGA_DL3: CCD (RP1.5), FPGA (U100.79)
FPGA_DL4: CCD (RP2.8), FPGA (U100.80)
FPGA_DL5: CCD (RP2.7), FPGA (U100.81)
FPGA_DL6: CCD (RP2.6), FPGA (U100.82)
FPGA_DL7: CCD (RP2.5), FPGA (U100.83)
FPGA_DL8: CCD (RP3.8), FPGA (U100.84)
FPGA_DL9: CCD (RP3.7), FPGA (U100.85)
FPGA_DL10: CCD (RP3.6), FPGA (U100.87)
FPGA_DL11: CCD (RP3.5), FPGA (U100.88)
FPGA_DL12: CCD (RP4.8), FPGA (U100.92)
FPGA_DL13: CCD (RP4.7), FPGA (U100.93)
FPGA_DR0: CCD (RP4.6), FPGA (U100.94)
FPGA_DR1: CCD (RP4.5), FPGA (U100.95)
FPGA_DR2: CCD (RP5.8), FPGA (U100.97)
FPGA_DR3: CCD (RP5.7), FPGA (U100.98)
FPGA_DR4: CCD (RP5.6), FPGA (U100.99)
FPGA_DR5: CCD (RP5.5), FPGA (U100.100)
FPGA_DR6: CCD (RP7.8), FPGA (U100.101)
FPGA_DR7: CCD (RP7.7), FPGA (U100.102)
FPGA_DR8: CCD (RP7.6), FPGA (U100.104)
FPGA_DR9: CCD (RP7.5), FPGA (U100.105)
FPGA_DR10: CCD (RP6.8), FPGA (U100.111)
FPGA_DR11: CCD (RP6.7), FPGA (U100.112)
FPGA_DR12: CCD (RP6.6), FPGA (U100.114)
FPGA_DR13: CCD (RP6.5), FPGA (U100.115)
I2C1_SCL: CPU (CTP.3 RT_TP.4), Power (R402.1 U400.2)
I2C1_SDA: CPU (CTP.2 RT_TP.5), Power (R403.1 U400.1)
ISP_CLPDM: CCD (U300.23 U301.23), FPGA (RP106.3)
ISP_CLPOB: CCD (U300.20 U301.20), FPGA (RP105.4)
ISP_DCLK: CCD (U300.16 U301.16), FPGA (RP105.1)
ISP_FD: CCD (U304.3), FPGA (RP107.1)
ISP_H1: CCD (U303.6), FPGA (RP103.2)
ISP_H2: CCD (U303.5), FPGA (RP103.3)
ISP_HD: CCD (U300.18 U301.18), FPGA (RP105.2)
ISP_HL: CCD (U303.1), FPGA (RP103.1)
ISP_nXSG2: CCD (U306.2), FPGA (RP104.3)
ISP_nXV1: CCD (U305.1), FPGA (RP104.1)
ISP_nXV2: CCD (U305.15), FPGA (RP104.2)
ISP_PBLK: CCD (U300.19 U301.19), FPGA (RP105.3)
ISP_RG: CCD (U303.15), FPGA (RP103.4)
ISP_SCK: CCD (U300.46 U301.46), CPU (RT_G1.7)
ISP_SDATA: CCD (U300.45 U301.45), CPU (RT_G1.6)
ISP_SHD: CCD (U300.22 U301.22), FPGA (RP106.2)
ISP_SHP: CCD (U300.21 U301.21), FPGA (RP106.1)
ISP_SHUT: CCD (C342.1 C343.1), FPGA (RP107.4)
ISP_SL: CCD (U300.44 U301.44), CPU (RT_G1.5)
ISP_VD: CCD (U300.24 U301.24), FPGA (RP106.4)
ONOFF: CPU (PWR.2 PWR.4), Power (R409.2)